# EAGLE schematic piezo-driver_v0.95-R002 (EAGLE 6.5.0)

## Sheet 1 of 3
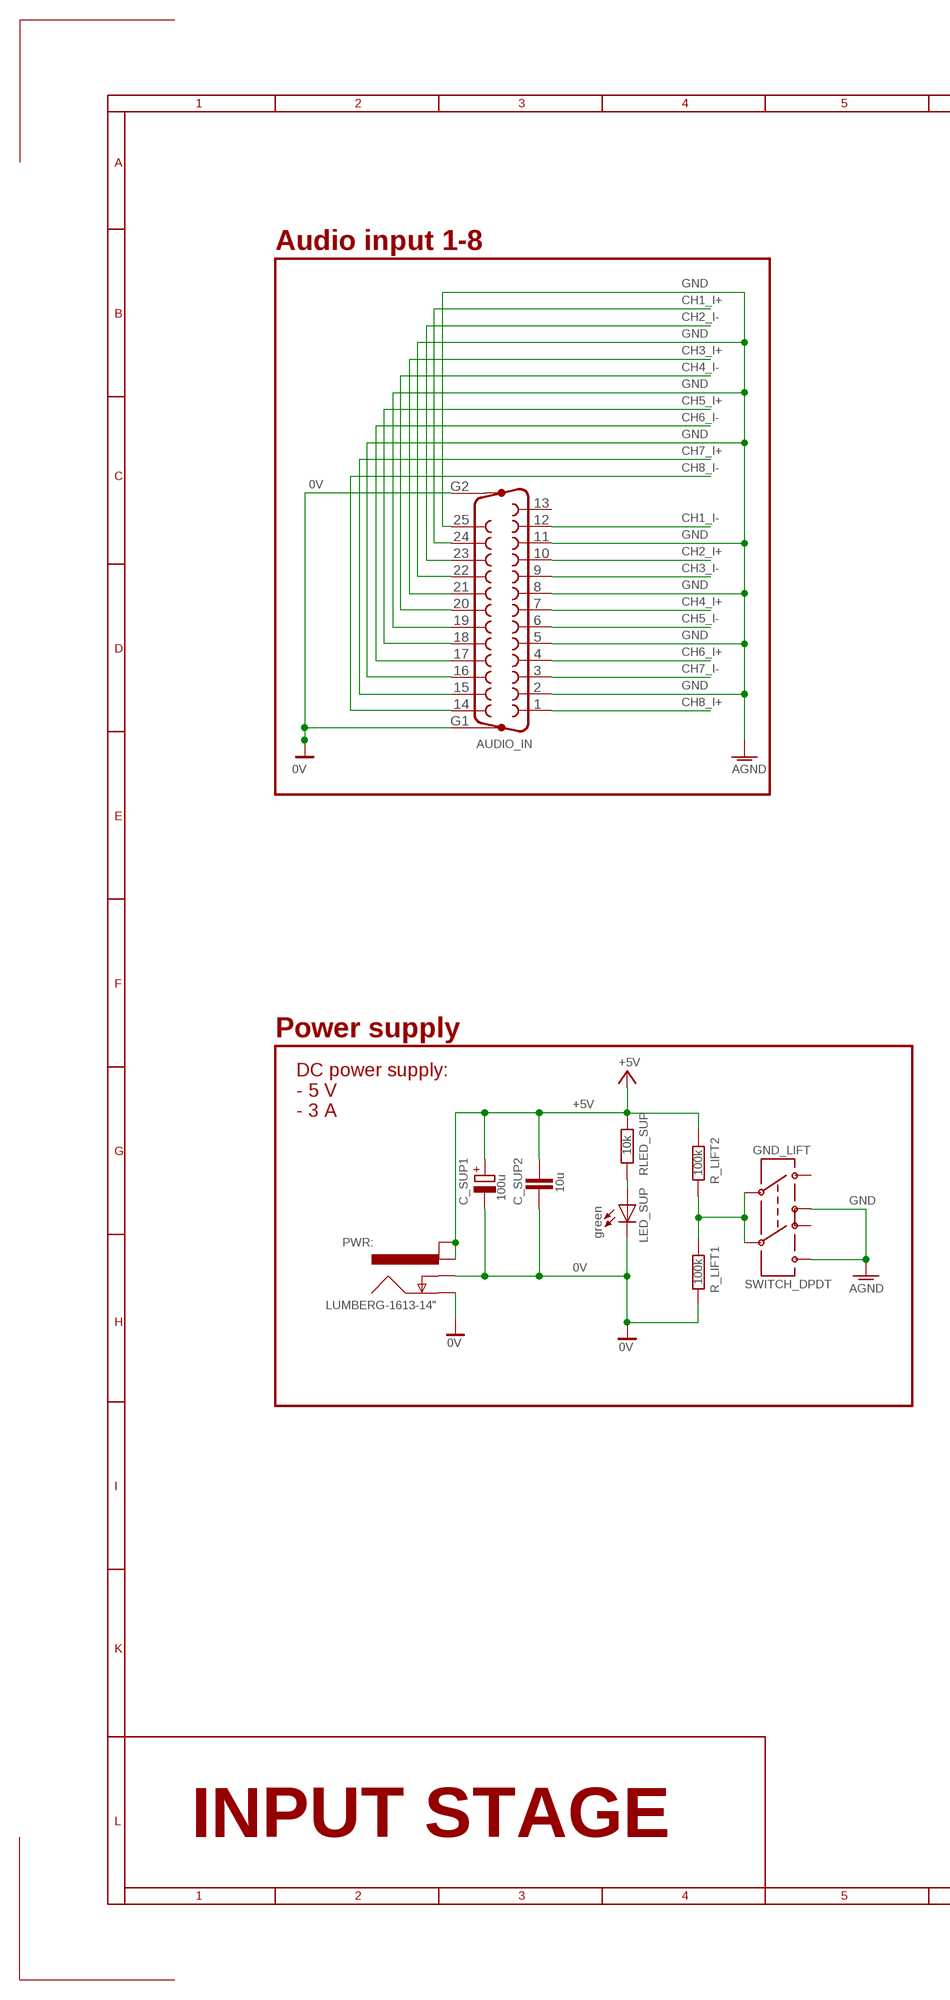
[diagram p0: schematic, sheet 1, part 1 of 2]
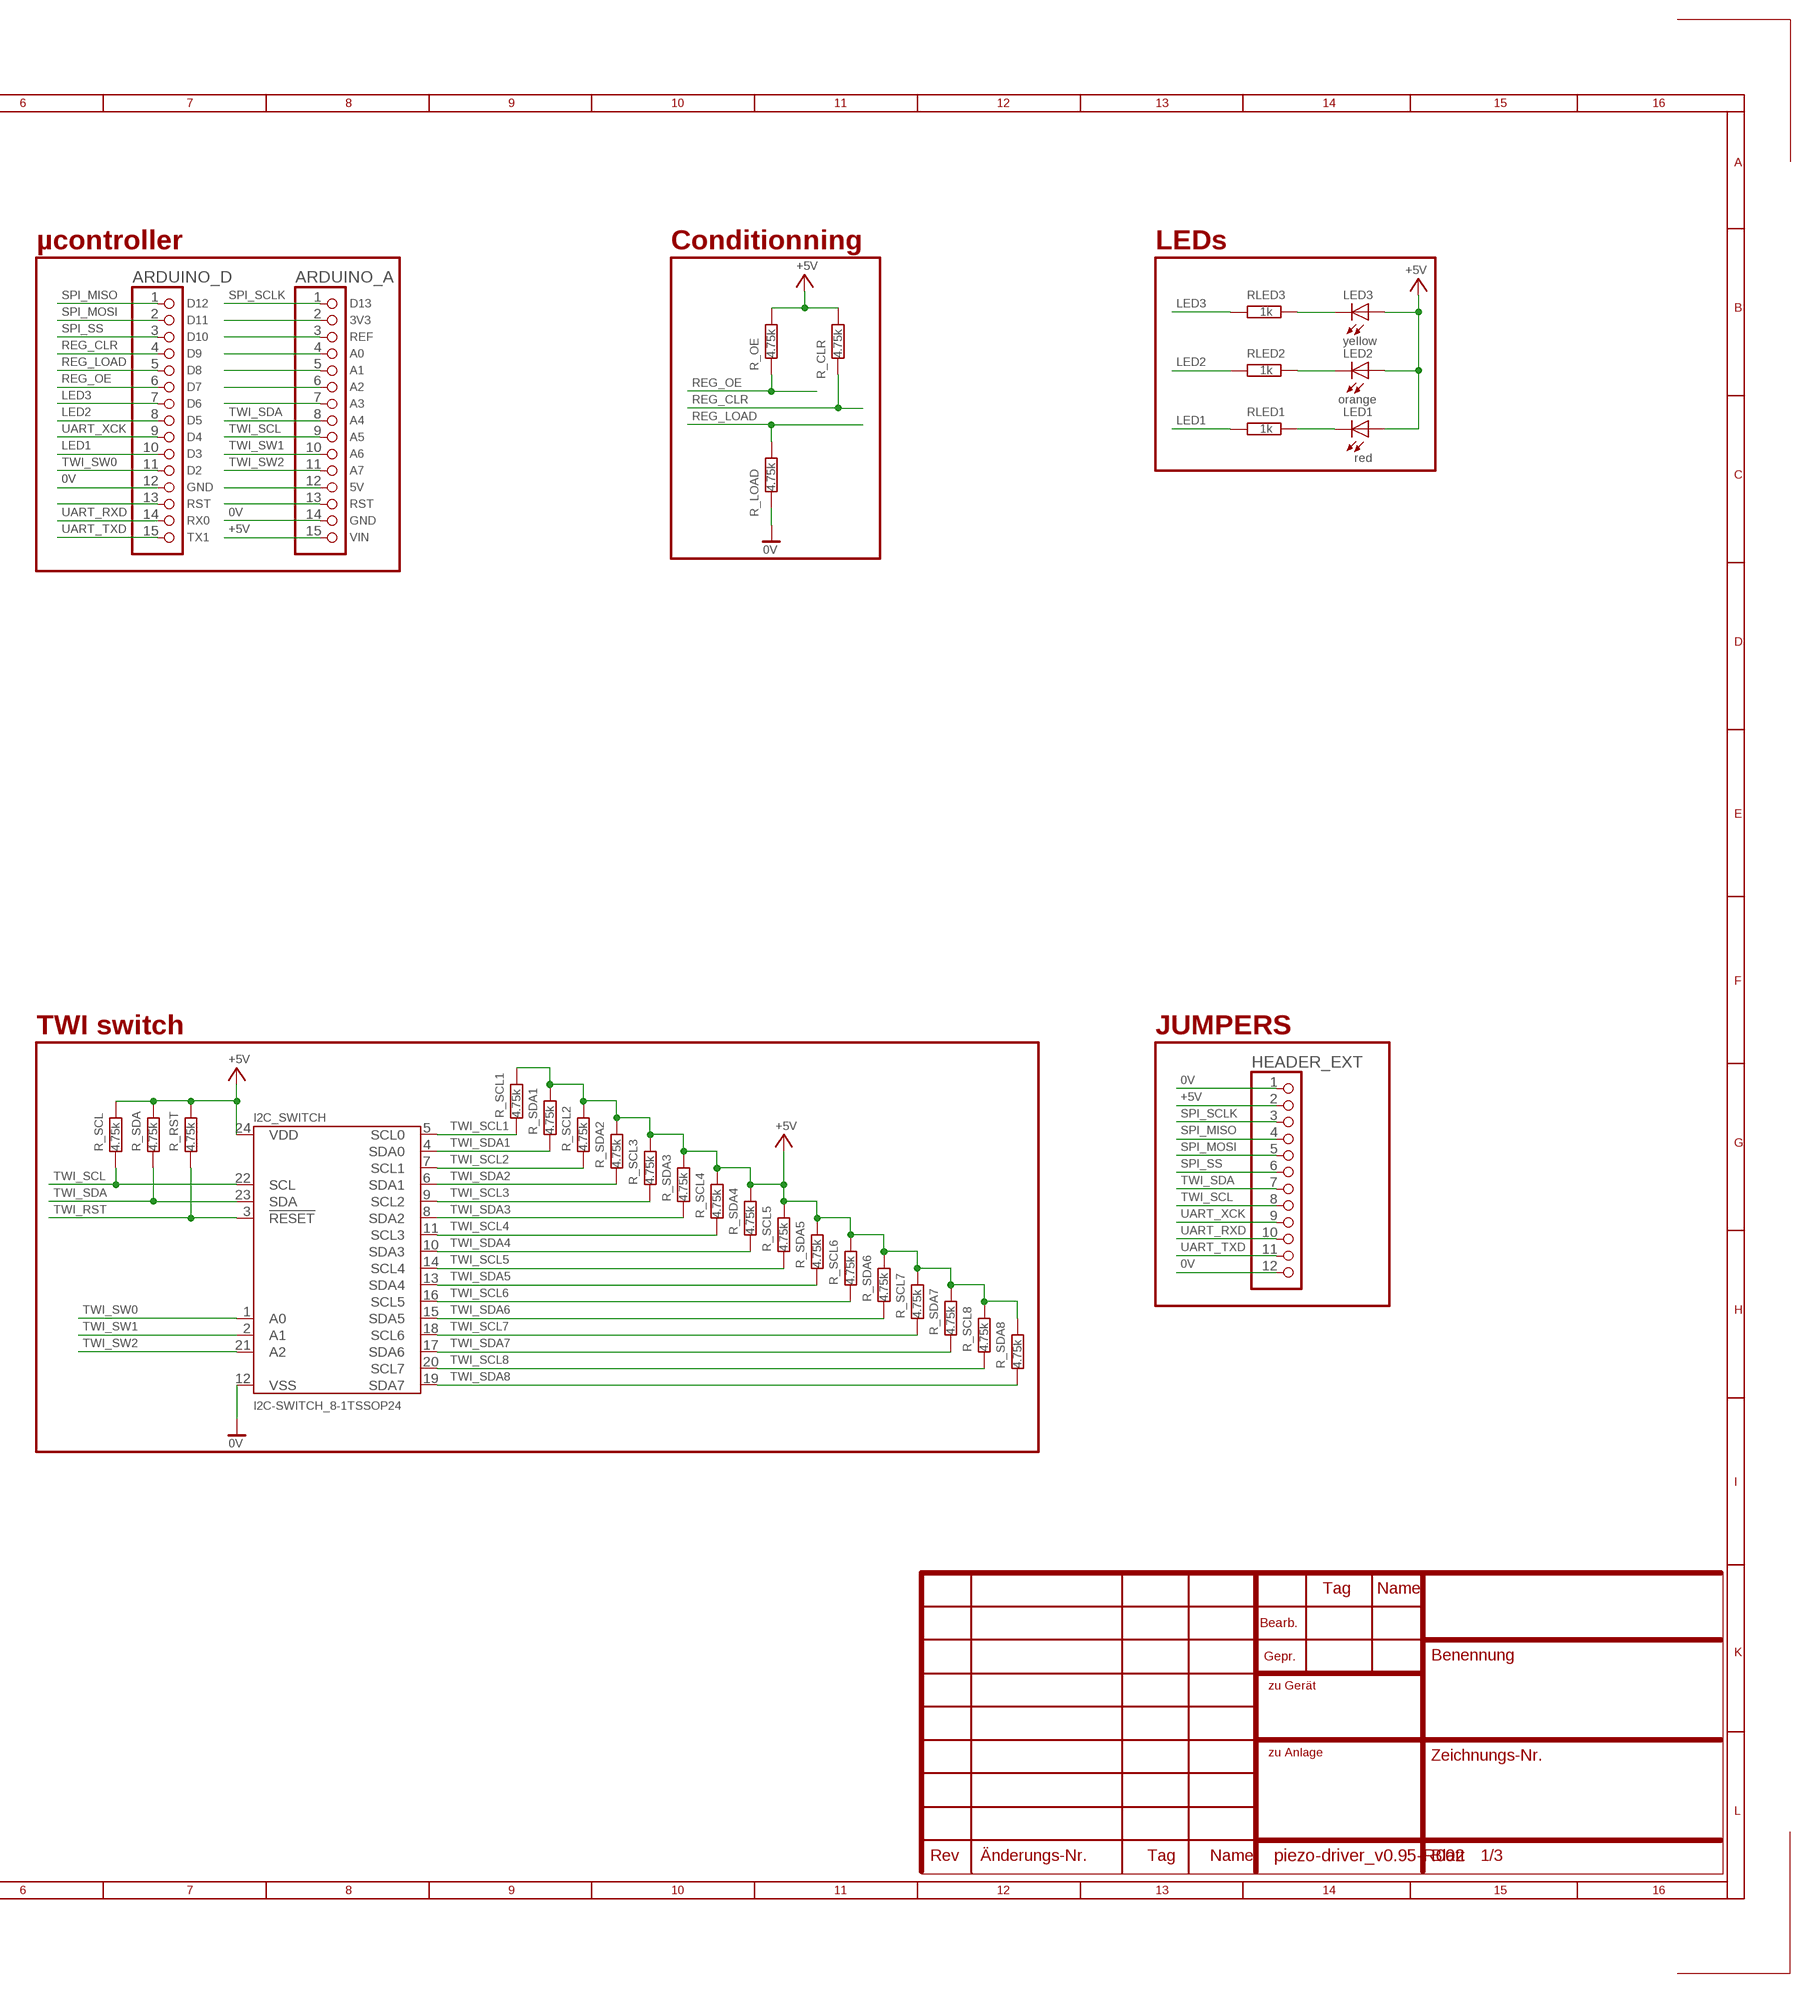
[diagram p1: schematic, sheet 1, part 2 of 2]

### Parts
ARDUINO_A  PINHD-1X15  [1X15]
ARDUINO_D  PINHD-1X15  [1X15]
AUDIO_IN  F25HP  [F25HP]
C_SUP1  100u  CAP_POL12061  [EIA3216]
C_SUP2  10u  C-EUC0805K  [C0805K]
GND_LIFT  SWITCH_DPDT  [SWITCH_JS202011]
HEADER_EXT  PINHD-1X12  [1X12]
I2C_SWITCH  I2C-SWITCH_8-1TSSOP24  [TSSOP24]
LED1  red  LED1206  [LED-1206]
LED2  orange  LED1206  [LED-1206]
LED3  yellow  LED1206  [LED-1206]
LED_SUP  green  LED1206  [LED-1206]
PWR:  LUMBERG-1613-14"  [LUMBERG-1613_14]
R_CLR  4.75k  R-EU_R0402  [R0402]
R_LIFT1  100k  R-EU_R0402  [R0402]
R_LIFT2  100k  R-EU_R0402  [R0402]
R_LOAD  4.75k  R-EU_R0402  [R0402]
R_OE  4.75k  R-EU_R0402  [R0402]
R_RST  4.75k  R-EU_R0402  [R0402]
R_SCL  4.75k  R-EU_R0402  [R0402]
R_SCL1  4.75k  R-EU_R0402  [R0402]
R_SCL2  4.75k  R-EU_R0402  [R0402]
R_SCL3  4.75k  R-EU_R0402  [R0402]
R_SCL4  4.75k  R-EU_R0402  [R0402]
R_SCL5  4.75k  R-EU_R0402  [R0402]
R_SCL6  4.75k  R-EU_R0402  [R0402]
R_SCL7  4.75k  R-EU_R0402  [R0402]
R_SCL8  4.75k  R-EU_R0402  [R0402]
R_SDA  4.75k  R-EU_R0402  [R0402]
R_SDA1  4.75k  R-EU_R0402  [R0402]
R_SDA2  4.75k  R-EU_R0402  [R0402]
R_SDA3  4.75k  R-EU_R0402  [R0402]
R_SDA4  4.75k  R-EU_R0402  [R0402]
R_SDA5  4.75k  R-EU_R0402  [R0402]
R_SDA6  4.75k  R-EU_R0402  [R0402]
R_SDA7  4.75k  R-EU_R0402  [R0402]
R_SDA8  4.75k  R-EU_R0402  [R0402]
RLED1  1k  R-EU_R0402  [R0402]
RLED2  1k  R-EU_R0402  [R0402]
RLED3  1k  R-EU_R0402  [R0402]
RLED_SUP  10k  R-EU_R0402  [R0402]

### Nets
0V: ARDUINO_A.14 ARDUINO_D.12 AUDIO_IN.G1 AUDIO_IN.G2 C_SUP1.C(-) C_SUP2.2 HEADER_EXT.1 HEADER_EXT.12 I2C_SWITCH.12(VSS) LED_SUP.C PWR:.1(GND) PWR:.2(GND_INS) R_LIFT1.1 R_LOAD.1 ; also sheet 2,3
+5V: ARDUINO_A.15 C_SUP1.A(+) C_SUP2.1 HEADER_EXT.2 I2C_SWITCH.24(VDD) LED1.A LED2.A LED3.A PWR:.3(PWR_1) PWR:.4(PWR_2) R_CLR.2 R_LIFT2.2 R_OE.2 R_RST.2 R_SCL1.2 R_SCL2.2 R_SCL3.2 R_SCL4.2 R_SCL5.2 R_SCL6.2 R_SCL7.2 R_SCL8.2 R_SCL.2 R_SDA1.2 R_SDA2.2 R_SDA3.2 R_SDA4.2 R_SDA5.2 R_SDA6.2 R_SDA7.2 R_SDA8.2 R_SDA.2 RLED_SUP.2 ; also sheet 2,3
A_3V3: ARDUINO_A.2
A_5V: ARDUINO_A.12
A_A0: ARDUINO_A.4
A_A1: ARDUINO_A.5
A_A2: ARDUINO_A.6
A_A3: ARDUINO_A.7
A_REF: ARDUINO_A.3
A_RST1: ARDUINO_D.13
A_RST2: ARDUINO_A.13
CH1_I+: AUDIO_IN.24 ; also sheet 2
CH1_I-: AUDIO_IN.12 ; also sheet 2
CH2_I+: AUDIO_IN.10 ; also sheet 2
CH2_I-: AUDIO_IN.23 ; also sheet 2
CH3_I+: AUDIO_IN.21 ; also sheet 2
CH3_I-: AUDIO_IN.9 ; also sheet 2
CH4_I+: AUDIO_IN.7 ; also sheet 2
CH4_I-: AUDIO_IN.20 ; also sheet 2
CH5_I+: AUDIO_IN.18 ; also sheet 2
CH5_I-: AUDIO_IN.6 ; also sheet 2
CH6_I+: AUDIO_IN.4 ; also sheet 2
CH6_I-: AUDIO_IN.17 ; also sheet 2
CH7_I+: AUDIO_IN.15 ; also sheet 2
CH7_I-: AUDIO_IN.3 ; also sheet 2
CH8_I+: AUDIO_IN.1 ; also sheet 2
CH8_I-: AUDIO_IN.14 ; also sheet 2
GND: AUDIO_IN.2 AUDIO_IN.5 AUDIO_IN.8 AUDIO_IN.11 AUDIO_IN.16 AUDIO_IN.19 AUDIO_IN.22 AUDIO_IN.25 GND_LIFT.1(T1A) GND_LIFT.6(T2A) ; supply symbol labelled AGND
LED1: ARDUINO_D.10 RLED1.1
LED2: ARDUINO_D.8 RLED2.1
LED3: ARDUINO_D.7 RLED3.1
N$15: LED_SUP.A RLED_SUP.1
N$68: LED3.C RLED3.2
N$69: LED2.C RLED2.2
N$70: LED1.C RLED1.2
N$1222: GND_LIFT.2(P1) GND_LIFT.5(P2) R_LIFT1.2 R_LIFT2.1
REG_CLR: ARDUINO_D.4 R_CLR.1 ; also sheet 3
REG_LOAD: ARDUINO_D.5 R_LOAD.2 ; also sheet 3
REG_OE: ARDUINO_D.6 R_OE.1 ; also sheet 3
SPI_MISO: ARDUINO_D.1 HEADER_EXT.4
SPI_MOSI: ARDUINO_D.2 HEADER_EXT.5 ; also sheet 3
SPI_SCLK: ARDUINO_A.1 HEADER_EXT.3 ; also sheet 3
SPI_SS: ARDUINO_D.3 HEADER_EXT.6
TWI_RST: I2C_SWITCH.3(!RESET) R_RST.1
TWI_SCL: ARDUINO_A.9 HEADER_EXT.8 I2C_SWITCH.22(SCL) R_SCL.1
TWI_SCL1: I2C_SWITCH.5(SCL0) R_SCL1.1 ; also sheet 2
TWI_SCL2: I2C_SWITCH.7(SCL1) R_SCL2.1 ; also sheet 2
TWI_SCL3: I2C_SWITCH.9(SCL2) R_SCL3.1 ; also sheet 2
TWI_SCL4: I2C_SWITCH.11(SCL3) R_SCL4.1 ; also sheet 2
TWI_SCL5: I2C_SWITCH.14(SCL4) R_SCL5.1 ; also sheet 2
TWI_SCL6: I2C_SWITCH.16(SCL5) R_SCL6.1 ; also sheet 2
TWI_SCL7: I2C_SWITCH.18(SCL6) R_SCL7.1 ; also sheet 2
TWI_SCL8: I2C_SWITCH.20(SCL7) R_SCL8.1 ; also sheet 2
TWI_SDA: ARDUINO_A.8 HEADER_EXT.7 I2C_SWITCH.23(SDA) R_SDA.1
TWI_SDA1: I2C_SWITCH.4(SDA0) R_SDA1.1 ; also sheet 2
TWI_SDA2: I2C_SWITCH.6(SDA1) R_SDA2.1 ; also sheet 2
TWI_SDA3: I2C_SWITCH.8(SDA2) R_SDA3.1 ; also sheet 2
TWI_SDA4: I2C_SWITCH.10(SDA3) R_SDA4.1 ; also sheet 2
TWI_SDA5: I2C_SWITCH.13(SDA4) R_SDA5.1 ; also sheet 2
TWI_SDA6: I2C_SWITCH.15(SDA5) R_SDA6.1 ; also sheet 2
TWI_SDA7: I2C_SWITCH.17(SDA6) R_SDA7.1 ; also sheet 2
TWI_SDA8: I2C_SWITCH.19(SDA7) R_SDA8.1 ; also sheet 2
TWI_SW0: ARDUINO_D.11 I2C_SWITCH.1(A0)
TWI_SW1: ARDUINO_A.10 I2C_SWITCH.2(A1)
TWI_SW2: ARDUINO_A.11 I2C_SWITCH.21(A2)
UART_RXD: ARDUINO_D.14 HEADER_EXT.10
UART_TXD: ARDUINO_D.15 HEADER_EXT.11
UART_XCK: ARDUINO_D.9 HEADER_EXT.9
Unconnected: AUDIO_IN.13 GND_LIFT.3(T1B) GND_LIFT.4(T2B)

### Notes on the sheet
- Audio input 1-8 | µcontroller | Conditionning | LEDs
- D12 | D13
- D11 | 3V3
- D10 | REF
- D9 | A0
- D8 | A1
- D7 | A2
- D6 | A3
- D5 | A4
- D4 | A5
- D3 | A6
- D2 | A7
- GND | 5V
- RST | RST
- RX0 | GND
- TX1 | VIN
- Power supply | TWI switch | JUMPERS
- DC power supply:
  - 5 V
  - 3 A
- INPUT STAGE

## Sheet 2 of 3
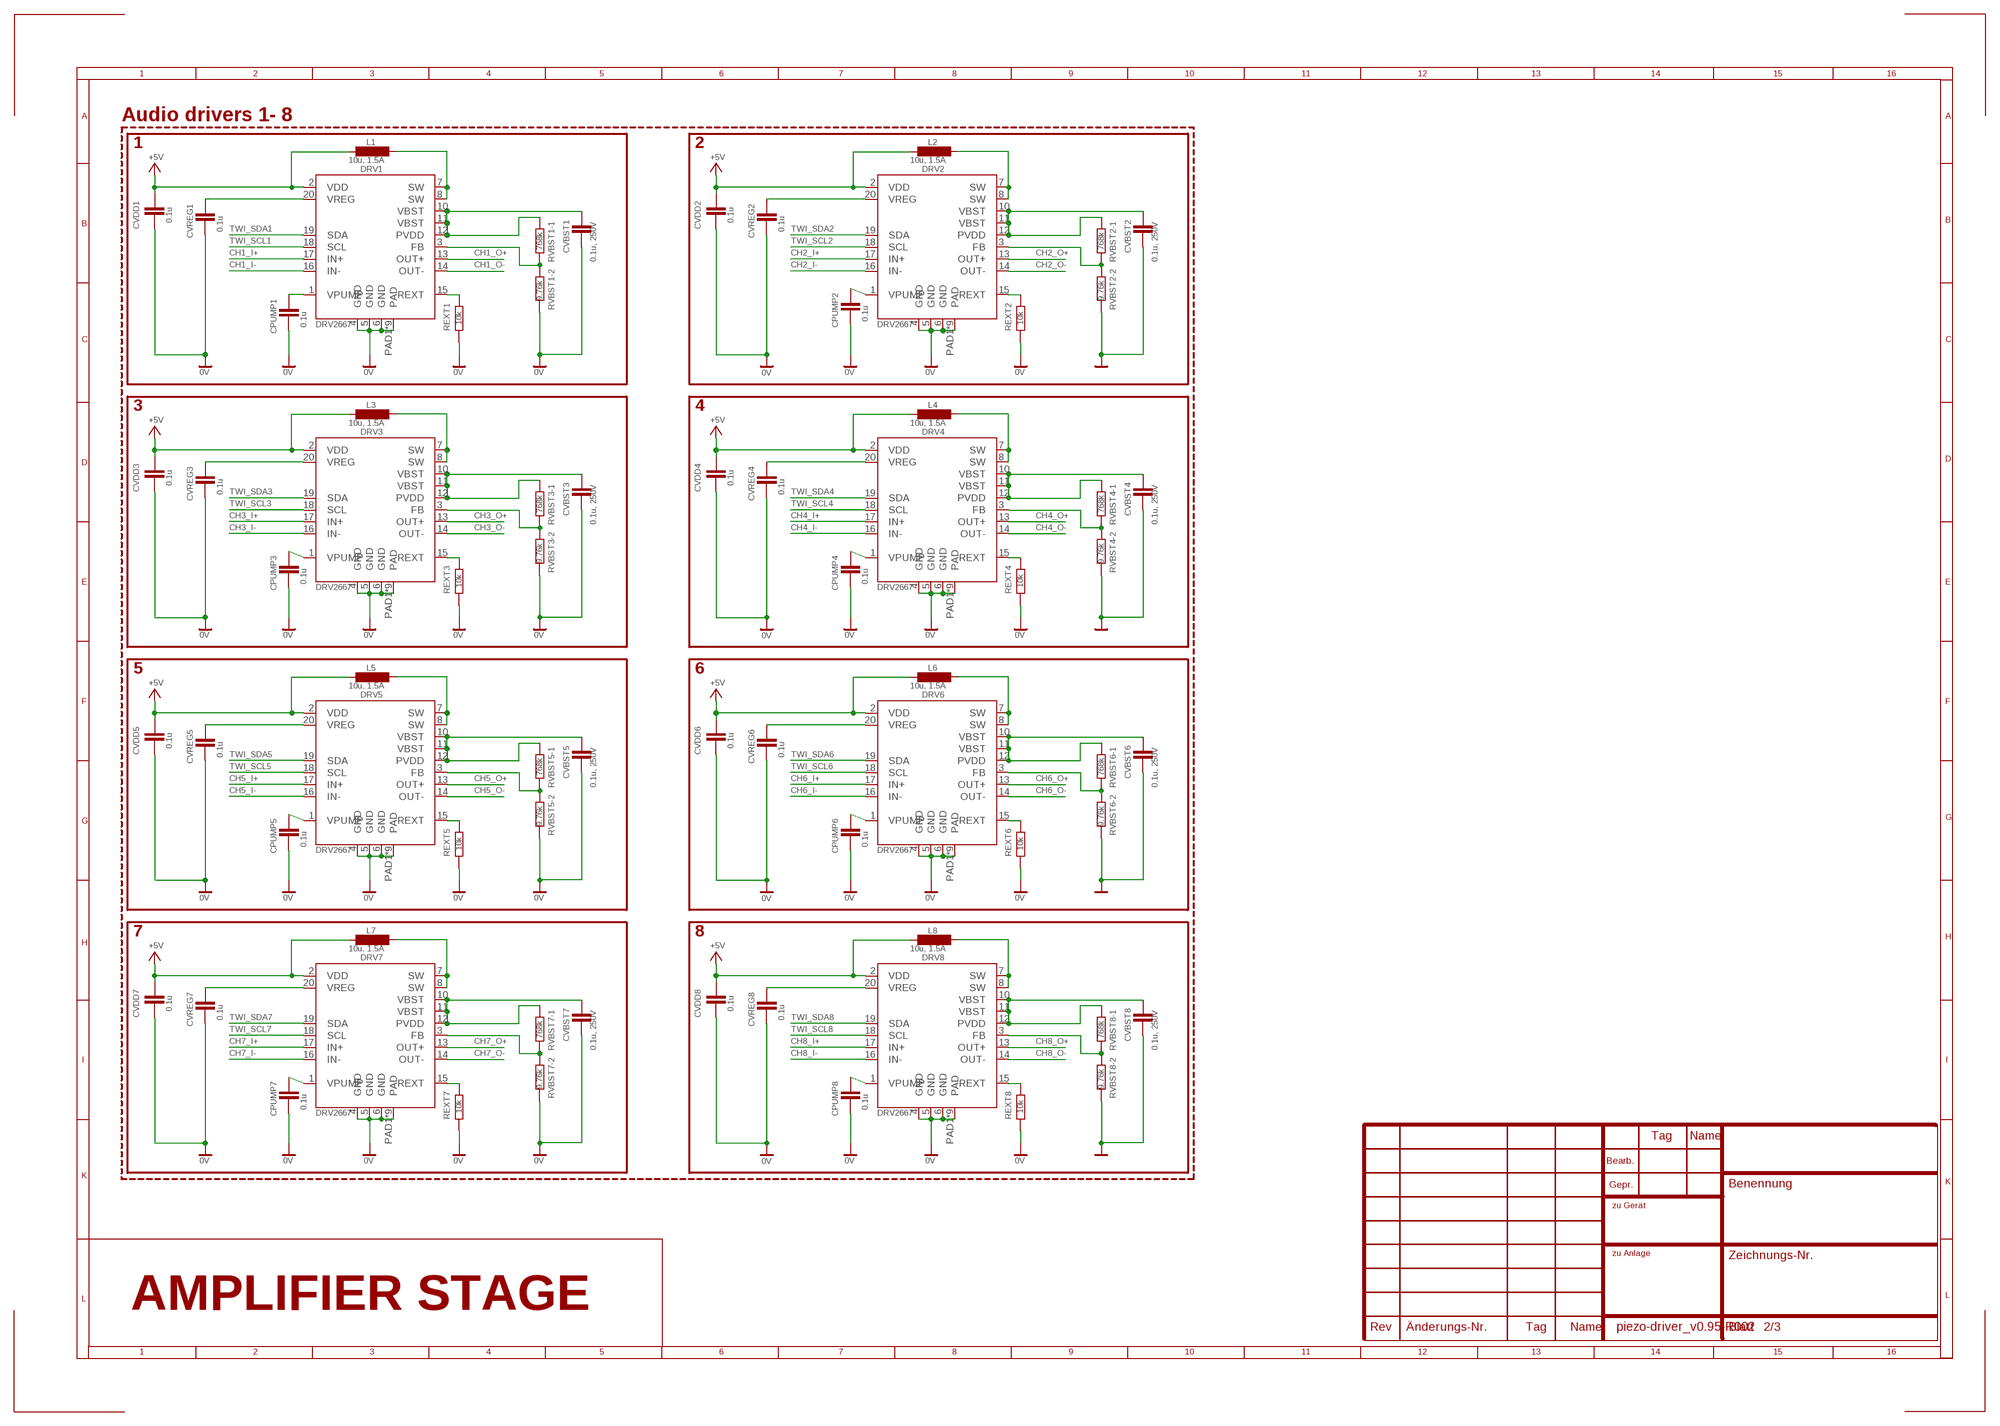
[diagram p2: schematic, sheet 2]

### Parts
CPUMP1  0.1u  C-EUC0402  [C0402]
CPUMP2  0.1u  C-EUC0402  [C0402]
CPUMP3  0.1u  C-EUC0402  [C0402]
CPUMP4  0.1u  C-EUC0402  [C0402]
CPUMP5  0.1u  C-EUC0402  [C0402]
CPUMP6  0.1u  C-EUC0402  [C0402]
CPUMP7  0.1u  C-EUC0402  [C0402]
CPUMP8  0.1u  C-EUC0402  [C0402]
CVBST1  0.1u, 250V  C-EUC0805  [C0805]
CVBST2  0.1u, 250V  C-EUC0805  [C0805]
CVBST3  0.1u, 250V  C-EUC0805  [C0805]
CVBST4  0.1u, 250V  C-EUC0805  [C0805]
CVBST5  0.1u, 250V  C-EUC0805  [C0805]
CVBST6  0.1u, 250V  C-EUC0805  [C0805]
CVBST7  0.1u, 250V  C-EUC0805  [C0805]
CVBST8  0.1u, 250V  C-EUC0805  [C0805]
CVDD1  0.1u  C-EUC0402  [C0402]
CVDD2  0.1u  C-EUC0402  [C0402]
CVDD3  0.1u  C-EUC0402  [C0402]
CVDD4  0.1u  C-EUC0402  [C0402]
CVDD5  0.1u  C-EUC0402  [C0402]
CVDD6  0.1u  C-EUC0402  [C0402]
CVDD7  0.1u  C-EUC0402  [C0402]
CVDD8  0.1u  C-EUC0402  [C0402]
CVREG1  0.1u  C-EUC0402  [C0402]
CVREG2  0.1u  C-EUC0402  [C0402]
CVREG3  0.1u  C-EUC0402  [C0402]
CVREG4  0.1u  C-EUC0402  [C0402]
CVREG5  0.1u  C-EUC0402  [C0402]
CVREG6  0.1u  C-EUC0402  [C0402]
CVREG7  0.1u  C-EUC0402  [C0402]
CVREG8  0.1u  C-EUC0402  [C0402]
DRV1  DRV2667  [QFN-20_9TH]
DRV2  DRV2667  [QFN-20_9TH]
DRV3  DRV2667  [QFN-20_9TH]
DRV4  DRV2667  [QFN-20_9TH]
DRV5  DRV2667  [QFN-20_9TH]
DRV6  DRV2667  [QFN-20_9TH]
DRV7  DRV2667  [QFN-20_9TH]
DRV8  DRV2667  [QFN-20_9TH]
L1  10u, 1.5A  L-EU4.0X4.0  [L4.0X4.0]
L2  10u, 1.5A  L-EU4.0X4.0  [L4.0X4.0]
L3  10u, 1.5A  L-EU4.0X4.0  [L4.0X4.0]
L4  10u, 1.5A  L-EU4.0X4.0  [L4.0X4.0]
L5  10u, 1.5A  L-EU4.0X4.0  [L4.0X4.0]
L6  10u, 1.5A  L-EU4.0X4.0  [L4.0X4.0]
L7  10u, 1.5A  L-EU4.0X4.0  [L4.0X4.0]
L8  10u, 1.5A  L-EU4.0X4.0  [L4.0X4.0]
REXT1  10k  R-EU_R0402  [R0402]
REXT2  10k  R-EU_R0402  [R0402]
REXT3  10k  R-EU_R0402  [R0402]
REXT4  10k  R-EU_R0402  [R0402]
REXT5  10k  R-EU_R0402  [R0402]
REXT6  10k  R-EU_R0402  [R0402]
REXT7  10k  R-EU_R0402  [R0402]
REXT8  10k  R-EU_R0402  [R0402]
RVBST1-1  768k  R-EU_R0402  [R0402]
RVBST1-2  9.76k  R-EU_R0402  [R0402]
RVBST2-1  768k  R-EU_R0402  [R0402]
RVBST2-2  9.76k  R-EU_R0402  [R0402]
RVBST3-1  768k  R-EU_R0402  [R0402]
RVBST3-2  9.76k  R-EU_R0402  [R0402]
RVBST4-1  768k  R-EU_R0402  [R0402]
RVBST4-2  9.76k  R-EU_R0402  [R0402]
RVBST5-1  768k  R-EU_R0402  [R0402]
RVBST5-2  9.76k  R-EU_R0402  [R0402]
RVBST6-1  768k  R-EU_R0402  [R0402]
RVBST6-2  9.76k  R-EU_R0402  [R0402]
RVBST7-1  768k  R-EU_R0402  [R0402]
RVBST7-2  9.76k  R-EU_R0402  [R0402]
RVBST8-1  768k  R-EU_R0402  [R0402]
RVBST8-2  9.76k  R-EU_R0402  [R0402]

### Nets
0V: CPUMP1.2 CPUMP2.2 CPUMP3.2 CPUMP4.2 CPUMP5.2 CPUMP6.2 CPUMP7.2 CPUMP8.2 CVBST1.2 CVBST2.2 CVBST3.2 CVBST4.2 CVBST5.2 CVBST6.2 CVBST7.2 CVBST8.2 CVDD1.2 CVDD2.2 CVDD3.2 CVDD4.2 CVDD5.2 CVDD6.2 CVDD7.2 CVDD8.2 CVREG1.2 CVREG2.2 CVREG3.2 CVREG4.2 CVREG5.2 CVREG6.2 CVREG7.2 CVREG8.2 DRV1.4(GND) DRV1.5(GND) DRV1.6(GND) DRV1.PAD1(PAD) DRV1.PAD2(PAD) DRV1.PAD3(PAD) DRV1.PAD4(PAD) DRV1.PAD5(PAD) DRV1.PAD6(PAD) DRV1.PAD7(PAD) DRV1.PAD8(PAD) DRV1.PAD9(PAD) DRV2.4(GND) DRV2.5(GND) DRV2.6(GND) DRV2.PAD1(PAD) DRV2.PAD2(PAD) DRV2.PAD3(PAD) DRV2.PAD4(PAD) DRV2.PAD5(PAD) DRV2.PAD6(PAD) DRV2.PAD7(PAD) DRV2.PAD8(PAD) DRV2.PAD9(PAD) DRV3.4(GND) DRV3.5(GND) DRV3.6(GND) DRV3.PAD1(PAD) DRV3.PAD2(PAD) DRV3.PAD3(PAD) DRV3.PAD4(PAD) DRV3.PAD5(PAD) DRV3.PAD6(PAD) DRV3.PAD7(PAD) DRV3.PAD8(PAD) DRV3.PAD9(PAD) DRV4.4(GND) DRV4.5(GND) DRV4.6(GND) DRV4.PAD1(PAD) DRV4.PAD2(PAD) DRV4.PAD3(PAD) DRV4.PAD4(PAD) DRV4.PAD5(PAD) DRV4.PAD6(PAD) DRV4.PAD7(PAD) DRV4.PAD8(PAD) DRV4.PAD9(PAD) DRV5.4(GND) DRV5.5(GND) DRV5.6(GND) DRV5.PAD1(PAD) DRV5.PAD2(PAD) DRV5.PAD3(PAD) DRV5.PAD4(PAD) DRV5.PAD5(PAD) DRV5.PAD6(PAD) DRV5.PAD7(PAD) DRV5.PAD8(PAD) DRV5.PAD9(PAD) DRV6.4(GND) DRV6.5(GND) DRV6.6(GND) DRV6.PAD1(PAD) DRV6.PAD2(PAD) DRV6.PAD3(PAD) DRV6.PAD4(PAD) DRV6.PAD5(PAD) DRV6.PAD6(PAD) DRV6.PAD7(PAD) DRV6.PAD8(PAD) DRV6.PAD9(PAD) DRV7.4(GND) DRV7.5(GND) DRV7.6(GND) DRV7.PAD1(PAD) DRV7.PAD2(PAD) DRV7.PAD3(PAD) DRV7.PAD4(PAD) DRV7.PAD5(PAD) DRV7.PAD6(PAD) DRV7.PAD7(PAD) DRV7.PAD8(PAD) DRV7.PAD9(PAD) DRV8.4(GND) DRV8.5(GND) DRV8.6(GND) DRV8.PAD1(PAD) DRV8.PAD2(PAD) DRV8.PAD3(PAD) DRV8.PAD4(PAD) DRV8.PAD5(PAD) DRV8.PAD6(PAD) DRV8.PAD7(PAD) DRV8.PAD8(PAD) DRV8.PAD9(PAD) REXT1.1 REXT2.1 REXT3.1 REXT4.1 REXT5.1 REXT6.1 REXT7.1 REXT8.1 RVBST1-2.1 RVBST2-2.1 RVBST3-2.1 RVBST4-2.1 RVBST5-2.1 RVBST6-2.1 RVBST7-2.1 RVBST8-2.1 ; also sheet 1,3
+5V: CVDD1.1 CVDD2.1 CVDD3.1 CVDD4.1 CVDD5.1 CVDD6.1 CVDD7.1 CVDD8.1 DRV1.2(VDD) DRV2.2(VDD) DRV3.2(VDD) DRV4.2(VDD) DRV5.2(VDD) DRV6.2(VDD) DRV7.2(VDD) DRV8.2(VDD) L1.2 L2.2 L3.2 L4.2 L5.2 L6.2 L7.2 L8.2 ; also sheet 1,3
CH1_I+: DRV1.17(IN+) ; also sheet 1
CH1_I-: DRV1.16(IN-) ; also sheet 1
CH1_O+: DRV1.13(OUT+) ; also sheet 3
CH1_O-: DRV1.14(OUT-) ; also sheet 3
CH2_I+: DRV2.17(IN+) ; also sheet 1
CH2_I-: DRV2.16(IN-) ; also sheet 1
CH2_O+: DRV2.13(OUT+) ; also sheet 3
CH2_O-: DRV2.14(OUT-) ; also sheet 3
CH3_I+: DRV3.17(IN+) ; also sheet 1
CH3_I-: DRV3.16(IN-) ; also sheet 1
CH3_O+: DRV3.13(OUT+) ; also sheet 3
CH3_O-: DRV3.14(OUT-) ; also sheet 3
CH4_I+: DRV4.17(IN+) ; also sheet 1
CH4_I-: DRV4.16(IN-) ; also sheet 1
CH4_O+: DRV4.13(OUT+) ; also sheet 3
CH4_O-: DRV4.14(OUT-) ; also sheet 3
CH5_I+: DRV5.17(IN+) ; also sheet 1
CH5_I-: DRV5.16(IN-) ; also sheet 1
CH5_O+: DRV5.13(OUT+) ; also sheet 3
CH5_O-: DRV5.14(OUT-) ; also sheet 3
CH6_I+: DRV6.17(IN+) ; also sheet 1
CH6_I-: DRV6.16(IN-) ; also sheet 1
CH6_O+: DRV6.13(OUT+) ; also sheet 3
CH6_O-: DRV6.14(OUT-) ; also sheet 3
CH7_I+: DRV7.17(IN+) ; also sheet 1
CH7_I-: DRV7.16(IN-) ; also sheet 1
CH7_O+: DRV7.13(OUT+) ; also sheet 3
CH7_O-: DRV7.14(OUT-) ; also sheet 3
CH8_I+: DRV8.17(IN+) ; also sheet 1
CH8_I-: DRV8.16(IN-) ; also sheet 1
CH8_O+: DRV8.13(OUT+) ; also sheet 3
CH8_O-: DRV8.14(OUT-) ; also sheet 3
CVBST1: CVBST1.1 DRV1.10(VBST) DRV1.11(VBST) DRV1.12(PVDD) RVBST1-1.2
CVBST2: CVBST2.1 DRV2.10(VBST) DRV2.11(VBST) DRV2.12(PVDD) RVBST2-1.2
CVBST3: CVBST3.1 DRV3.10(VBST) DRV3.11(VBST) DRV3.12(PVDD) RVBST3-1.2
CVBST4: CVBST4.1 DRV4.10(VBST) DRV4.11(VBST) DRV4.12(PVDD) RVBST4-1.2
CVBST5: CVBST5.1 DRV5.10(VBST) DRV5.11(VBST) DRV5.12(PVDD) RVBST5-1.2
CVBST6: CVBST6.1 DRV6.10(VBST) DRV6.11(VBST) DRV6.12(PVDD) RVBST6-1.2
CVBST7: CVBST7.1 DRV7.10(VBST) DRV7.11(VBST) DRV7.12(PVDD) RVBST7-1.2
CVBST8: CVBST8.1 DRV8.10(VBST) DRV8.11(VBST) DRV8.12(PVDD) RVBST8-1.2
L1: DRV1.7(SW) DRV1.8(SW) L1.1
L2: DRV2.7(SW) DRV2.8(SW) L2.1
L3: DRV3.7(SW) DRV3.8(SW) L3.1
L4: DRV4.7(SW) DRV4.8(SW) L4.1
L5: DRV5.7(SW) DRV5.8(SW) L5.1
L6: DRV6.7(SW) DRV6.8(SW) L6.1
L7: DRV7.7(SW) DRV7.8(SW) L7.1
L8: DRV8.7(SW) DRV8.8(SW) L8.1
N$4: DRV1.3(FB) RVBST1-1.1 RVBST1-2.2
N$5: DRV1.15(REXT) REXT1.2
N$6: CPUMP1.1 DRV1.1(VPUMP)
N$7: CVREG1.1 DRV1.20(VREG)
N$9: DRV3.3(FB) RVBST3-1.1 RVBST3-2.2
N$10: DRV3.15(REXT) REXT3.2
N$11: CPUMP3.1 DRV3.1(VPUMP)
N$12: CVREG3.1 DRV3.20(VREG)
N$16: DRV4.3(FB) RVBST4-1.1 RVBST4-2.2
N$17: DRV4.15(REXT) REXT4.2
N$18: CPUMP4.1 DRV4.1(VPUMP)
N$19: CVREG4.1 DRV4.20(VREG)
N$23: DRV2.3(FB) RVBST2-1.1 RVBST2-2.2
N$24: DRV2.15(REXT) REXT2.2
N$25: CPUMP2.1 DRV2.1(VPUMP)
N$26: CVREG2.1 DRV2.20(VREG)
N$28: DRV5.3(FB) RVBST5-1.1 RVBST5-2.2
N$29: DRV5.15(REXT) REXT5.2
N$30: CPUMP5.1 DRV5.1(VPUMP)
N$31: CVREG5.1 DRV5.20(VREG)
N$34: DRV6.3(FB) RVBST6-1.1 RVBST6-2.2
N$35: DRV6.15(REXT) REXT6.2
N$36: CPUMP6.1 DRV6.1(VPUMP)
N$37: CVREG6.1 DRV6.20(VREG)
N$40: DRV7.3(FB) RVBST7-1.1 RVBST7-2.2
N$41: DRV7.15(REXT) REXT7.2
N$42: CPUMP7.1 DRV7.1(VPUMP)
N$43: CVREG7.1 DRV7.20(VREG)
N$46: DRV8.3(FB) RVBST8-1.1 RVBST8-2.2
N$47: DRV8.15(REXT) REXT8.2
N$48: CPUMP8.1 DRV8.1(VPUMP)
N$49: CVREG8.1 DRV8.20(VREG)
TWI_SCL1: DRV1.18(SCL) ; also sheet 1
TWI_SCL2: DRV2.18(SCL) ; also sheet 1
TWI_SCL3: DRV3.18(SCL) ; also sheet 1
TWI_SCL4: DRV4.18(SCL) ; also sheet 1
TWI_SCL5: DRV5.18(SCL) ; also sheet 1
TWI_SCL6: DRV6.18(SCL) ; also sheet 1
TWI_SCL7: DRV7.18(SCL) ; also sheet 1
TWI_SCL8: DRV8.18(SCL) ; also sheet 1
TWI_SDA1: DRV1.19(SDA) ; also sheet 1
TWI_SDA2: DRV2.19(SDA) ; also sheet 1
TWI_SDA3: DRV3.19(SDA) ; also sheet 1
TWI_SDA4: DRV4.19(SDA) ; also sheet 1
TWI_SDA5: DRV5.19(SDA) ; also sheet 1
TWI_SDA6: DRV6.19(SDA) ; also sheet 1
TWI_SDA7: DRV7.19(SDA) ; also sheet 1
TWI_SDA8: DRV8.19(SDA) ; also sheet 1

### Notes on the sheet
- Audio drivers 1- 8
- 1 | 2
- 3 | 4
- 5 | 6
- 7 | 8
- AMPLIFIER STAGE

## Sheet 3 of 3
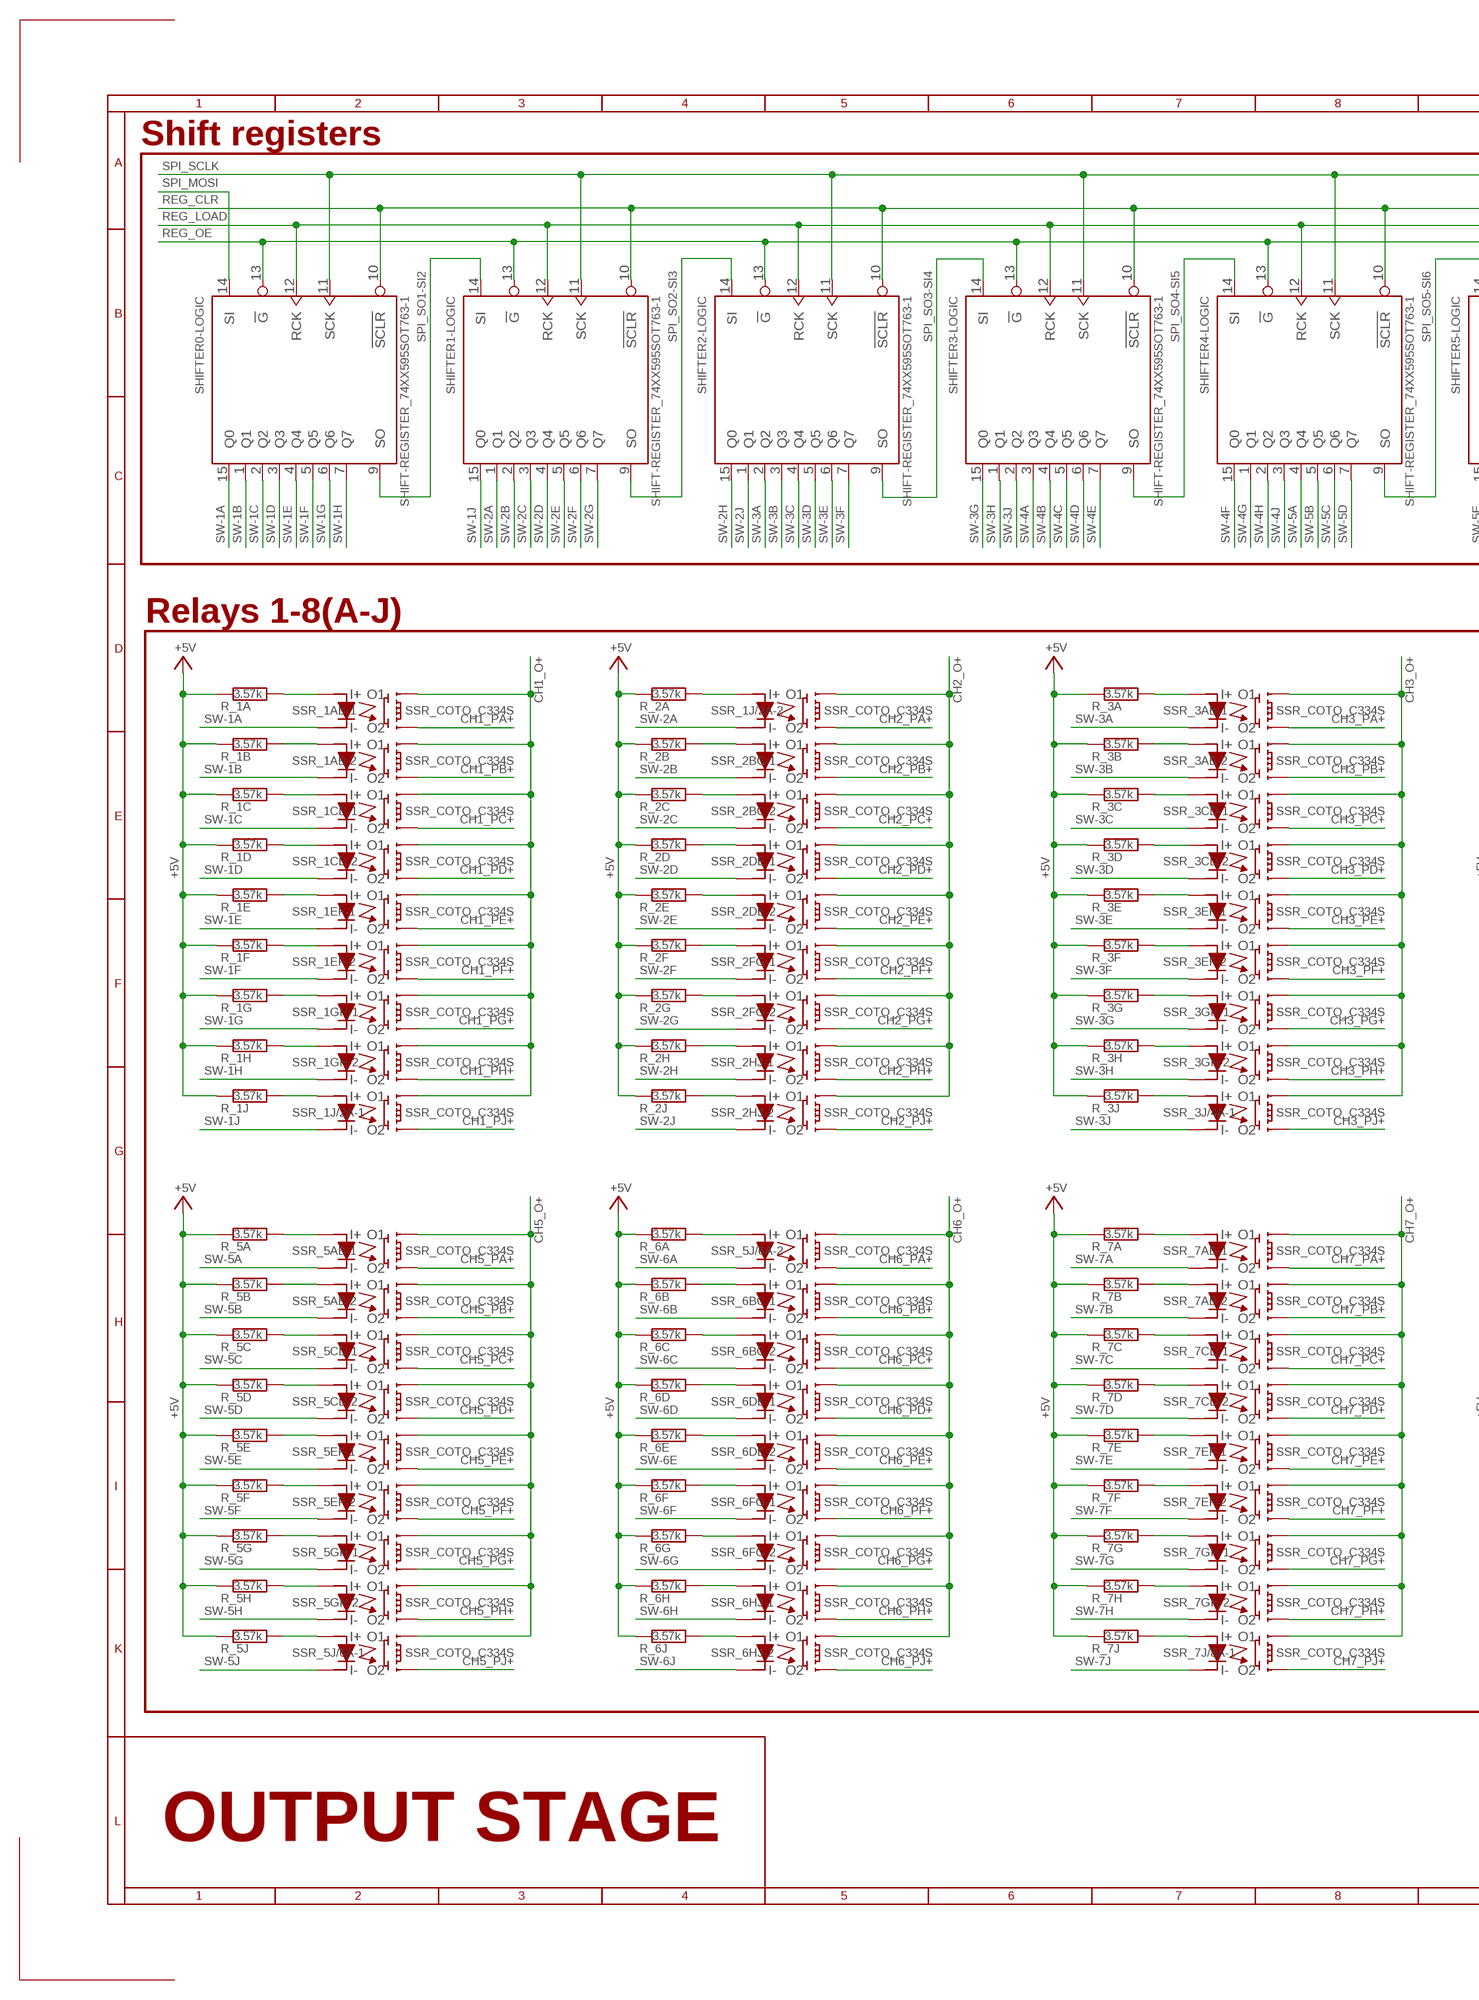
[diagram p3: schematic, sheet 3, part 1 of 2]
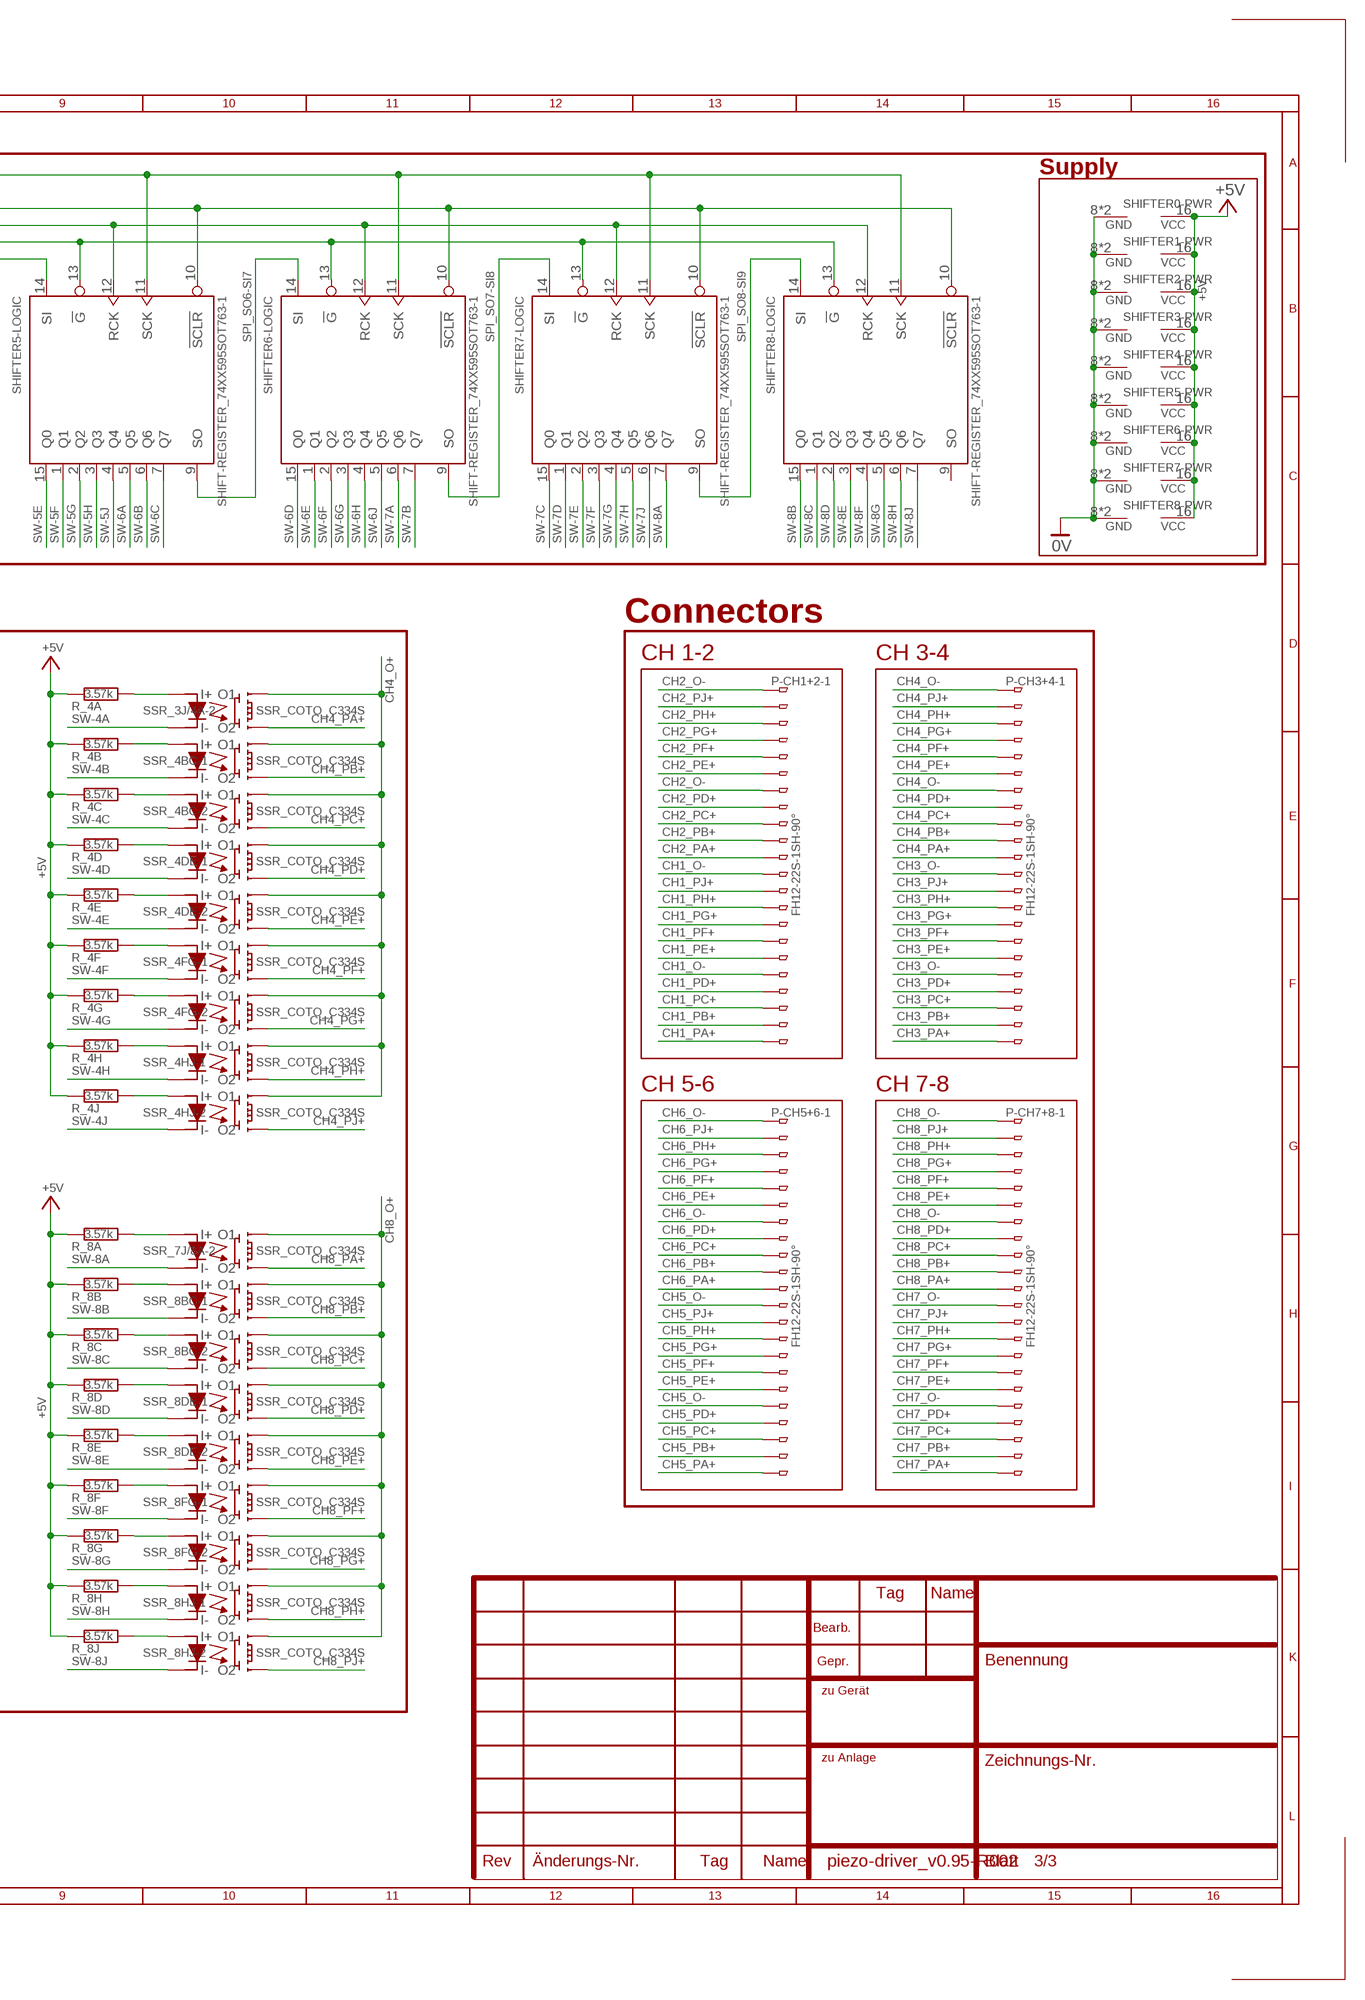
[diagram p4: schematic, sheet 3, part 2 of 2]

### Parts
P-CH1+2  FH12-22S-1SH-90°  [FH12-22S-1SH]
P-CH3+4  FH12-22S-1SH-90°  [FH12-22S-1SH]
P-CH5+6  FH12-22S-1SH-90°  [FH12-22S-1SH]
P-CH7+8  FH12-22S-1SH-90°  [FH12-22S-1SH]
R_1A  3.57k  R-EU_R0402  [R0402]
R_1B  3.57k  R-EU_R0402  [R0402]
R_1C  3.57k  R-EU_R0402  [R0402]
R_1D  3.57k  R-EU_R0402  [R0402]
R_1E  3.57k  R-EU_R0402  [R0402]
R_1F  3.57k  R-EU_R0402  [R0402]
R_1G  3.57k  R-EU_R0402  [R0402]
R_1H  3.57k  R-EU_R0402  [R0402]
R_1J  3.57k  R-EU_R0402  [R0402]
R_2A  3.57k  R-EU_R0402  [R0402]
R_2B  3.57k  R-EU_R0402  [R0402]
R_2C  3.57k  R-EU_R0402  [R0402]
R_2D  3.57k  R-EU_R0402  [R0402]
R_2E  3.57k  R-EU_R0402  [R0402]
R_2F  3.57k  R-EU_R0402  [R0402]
R_2G  3.57k  R-EU_R0402  [R0402]
R_2H  3.57k  R-EU_R0402  [R0402]
R_2J  3.57k  R-EU_R0402  [R0402]
R_3A  3.57k  R-EU_R0402  [R0402]
R_3B  3.57k  R-EU_R0402  [R0402]
R_3C  3.57k  R-EU_R0402  [R0402]
R_3D  3.57k  R-EU_R0402  [R0402]
R_3E  3.57k  R-EU_R0402  [R0402]
R_3F  3.57k  R-EU_R0402  [R0402]
R_3G  3.57k  R-EU_R0402  [R0402]
R_3H  3.57k  R-EU_R0402  [R0402]
R_3J  3.57k  R-EU_R0402  [R0402]
R_4A  3.57k  R-EU_R0402  [R0402]
R_4B  3.57k  R-EU_R0402  [R0402]
R_4C  3.57k  R-EU_R0402  [R0402]
R_4D  3.57k  R-EU_R0402  [R0402]
R_4E  3.57k  R-EU_R0402  [R0402]
R_4F  3.57k  R-EU_R0402  [R0402]
R_4G  3.57k  R-EU_R0402  [R0402]
R_4H  3.57k  R-EU_R0402  [R0402]
R_4J  3.57k  R-EU_R0402  [R0402]
R_5A  3.57k  R-EU_R0402  [R0402]
R_5B  3.57k  R-EU_R0402  [R0402]
R_5C  3.57k  R-EU_R0402  [R0402]
R_5D  3.57k  R-EU_R0402  [R0402]
R_5E  3.57k  R-EU_R0402  [R0402]
R_5F  3.57k  R-EU_R0402  [R0402]
R_5G  3.57k  R-EU_R0402  [R0402]
R_5H  3.57k  R-EU_R0402  [R0402]
R_5J  3.57k  R-EU_R0402  [R0402]
R_6A  3.57k  R-EU_R0402  [R0402]
R_6B  3.57k  R-EU_R0402  [R0402]
R_6C  3.57k  R-EU_R0402  [R0402]
R_6D  3.57k  R-EU_R0402  [R0402]
R_6E  3.57k  R-EU_R0402  [R0402]
R_6F  3.57k  R-EU_R0402  [R0402]
R_6G  3.57k  R-EU_R0402  [R0402]
R_6H  3.57k  R-EU_R0402  [R0402]
R_6J  3.57k  R-EU_R0402  [R0402]
R_7A  3.57k  R-EU_R0402  [R0402]
R_7B  3.57k  R-EU_R0402  [R0402]
R_7C  3.57k  R-EU_R0402  [R0402]
R_7D  3.57k  R-EU_R0402  [R0402]
R_7E  3.57k  R-EU_R0402  [R0402]
R_7F  3.57k  R-EU_R0402  [R0402]
R_7G  3.57k  R-EU_R0402  [R0402]
R_7H  3.57k  R-EU_R0402  [R0402]
R_7J  3.57k  R-EU_R0402  [R0402]
R_8A  3.57k  R-EU_R0402  [R0402]
R_8B  3.57k  R-EU_R0402  [R0402]
R_8C  3.57k  R-EU_R0402  [R0402]
R_8D  3.57k  R-EU_R0402  [R0402]
R_8E  3.57k  R-EU_R0402  [R0402]
R_8F  3.57k  R-EU_R0402  [R0402]
R_8G  3.57k  R-EU_R0402  [R0402]
R_8H  3.57k  R-EU_R0402  [R0402]
R_8J  3.57k  R-EU_R0402  [R0402]
SHIFTER0  SHIFT-REGISTER_74XX595SOT763-1  [SOT763-1]
SHIFTER1  SHIFT-REGISTER_74XX595SOT763-1  [SOT763-1]
SHIFTER2  SHIFT-REGISTER_74XX595SOT763-1  [SOT763-1]
SHIFTER3  SHIFT-REGISTER_74XX595SOT763-1  [SOT763-1]
SHIFTER4  SHIFT-REGISTER_74XX595SOT763-1  [SOT763-1]
SHIFTER5  SHIFT-REGISTER_74XX595SOT763-1  [SOT763-1]
SHIFTER6  SHIFT-REGISTER_74XX595SOT763-1  [SOT763-1]
SHIFTER7  SHIFT-REGISTER_74XX595SOT763-1  [SOT763-1]
SHIFTER8  SHIFT-REGISTER_74XX595SOT763-1  [SOT763-1]
SSR_1AB  SSR_COTO_C334S  [SOP8]
SSR_1CD  SSR_COTO_C334S  [SOP8]
SSR_1EF  SSR_COTO_C334S  [SOP8]
SSR_1GH  SSR_COTO_C334S  [SOP8]
SSR_1J/2A  SSR_COTO_C334S  [SOP8]
SSR_2BC  SSR_COTO_C334S  [SOP8]
SSR_2DE  SSR_COTO_C334S  [SOP8]
SSR_2FG  SSR_COTO_C334S  [SOP8]
SSR_2HJ  SSR_COTO_C334S  [SOP8]
SSR_3AB  SSR_COTO_C334S  [SOP8]
SSR_3CD  SSR_COTO_C334S  [SOP8]
SSR_3EF  SSR_COTO_C334S  [SOP8]
SSR_3GH  SSR_COTO_C334S  [SOP8]
SSR_3J/4A  SSR_COTO_C334S  [SOP8]
SSR_4BC  SSR_COTO_C334S  [SOP8]
SSR_4DE  SSR_COTO_C334S  [SOP8]
SSR_4FG  SSR_COTO_C334S  [SOP8]
SSR_4HJ  SSR_COTO_C334S  [SOP8]
SSR_5AB  SSR_COTO_C334S  [SOP8]
SSR_5CD  SSR_COTO_C334S  [SOP8]
SSR_5EF  SSR_COTO_C334S  [SOP8]
SSR_5GH  SSR_COTO_C334S  [SOP8]
SSR_5J/6A  SSR_COTO_C334S  [SOP8]
SSR_6BC  SSR_COTO_C334S  [SOP8]
SSR_6DE  SSR_COTO_C334S  [SOP8]
SSR_6FG  SSR_COTO_C334S  [SOP8]
SSR_6HJ  SSR_COTO_C334S  [SOP8]
SSR_7AB  SSR_COTO_C334S  [SOP8]
SSR_7CD  SSR_COTO_C334S  [SOP8]
SSR_7EF  SSR_COTO_C334S  [SOP8]
SSR_7GH  SSR_COTO_C334S  [SOP8]
SSR_7J/8A  SSR_COTO_C334S  [SOP8]
SSR_8BC  SSR_COTO_C334S  [SOP8]
SSR_8DE  SSR_COTO_C334S  [SOP8]
SSR_8FG  SSR_COTO_C334S  [SOP8]
SSR_8HJ  SSR_COTO_C334S  [SOP8]

### Nets
0V: SHIFTER0.8(-PWR:GND) SHIFTER0.PAD(-PWR:GND) SHIFTER1.8(-PWR:GND) SHIFTER1.PAD(-PWR:GND) SHIFTER2.8(-PWR:GND) SHIFTER2.PAD(-PWR:GND) SHIFTER3.8(-PWR:GND) SHIFTER3.PAD(-PWR:GND) SHIFTER4.8(-PWR:GND) SHIFTER4.PAD(-PWR:GND) SHIFTER5.8(-PWR:GND) SHIFTER5.PAD(-PWR:GND) SHIFTER6.8(-PWR:GND) SHIFTER6.PAD(-PWR:GND) SHIFTER7.8(-PWR:GND) SHIFTER7.PAD(-PWR:GND) SHIFTER8.8(-PWR:GND) SHIFTER8.PAD(-PWR:GND) ; also sheet 1,2
+5V: R_1A.2 R_1B.2 R_1C.2 R_1D.2 R_1E.2 R_1F.2 R_1G.2 R_1H.2 R_1J.2 R_2A.2 R_2B.2 R_2C.2 R_2D.2 R_2E.2 R_2F.2 R_2G.2 R_2H.2 R_2J.2 R_3A.2 R_3B.2 R_3C.2 R_3D.2 R_3E.2 R_3F.2 R_3G.2 R_3H.2 R_3J.2 R_4A.2 R_4B.2 R_4C.2 R_4D.2 R_4E.2 R_4F.2 R_4G.2 R_4H.2 R_4J.2 R_5A.2 R_5B.2 R_5C.2 R_5D.2 R_5E.2 R_5F.2 R_5G.2 R_5H.2 R_5J.2 R_6A.2 R_6B.2 R_6C.2 R_6D.2 R_6E.2 R_6F.2 R_6G.2 R_6H.2 R_6J.2 R_7A.2 R_7B.2 R_7C.2 R_7D.2 R_7E.2 R_7F.2 R_7G.2 R_7H.2 R_7J.2 R_8A.2 R_8B.2 R_8C.2 R_8D.2 R_8E.2 R_8F.2 R_8G.2 R_8H.2 R_8J.2 SHIFTER0.16(-PWR:VCC) SHIFTER1.16(-PWR:VCC) SHIFTER2.16(-PWR:VCC) SHIFTER3.16(-PWR:VCC) SHIFTER4.16(-PWR:VCC) SHIFTER5.16(-PWR:VCC) SHIFTER6.16(-PWR:VCC) SHIFTER7.16(-PWR:VCC) SHIFTER8.16(-PWR:VCC) ; also sheet 1,2
CH1_O+: SSR_1AB.5(-2:O1) SSR_1AB.7(-1:O1) SSR_1CD.5(-2:O1) SSR_1CD.7(-1:O1) SSR_1EF.5(-2:O1) SSR_1EF.7(-1:O1) SSR_1GH.5(-2:O1) SSR_1GH.7(-1:O1) SSR_1J/2A.7(-1:O1) ; also sheet 2
CH1_O-: P-CH1+2.12 P-CH1+2.18 ; also sheet 2
CH1_PA+: P-CH1+2.22 SSR_1AB.8(-1:O2)
CH1_PB+: P-CH1+2.21 SSR_1AB.6(-2:O2)
CH1_PC+: P-CH1+2.20 SSR_1CD.8(-1:O2)
CH1_PD+: P-CH1+2.19 SSR_1CD.6(-2:O2)
CH1_PE+: P-CH1+2.17 SSR_1EF.8(-1:O2)
CH1_PF+: P-CH1+2.16 SSR_1EF.6(-2:O2)
CH1_PG+: P-CH1+2.15 SSR_1GH.8(-1:O2)
CH1_PH+: P-CH1+2.14 SSR_1GH.6(-2:O2)
CH1_PJ+: P-CH1+2.13 SSR_1J/2A.8(-1:O2)
CH2_O+: SSR_1J/2A.5(-2:O1) SSR_2BC.5(-2:O1) SSR_2BC.7(-1:O1) SSR_2DE.5(-2:O1) SSR_2DE.7(-1:O1) SSR_2FG.5(-2:O1) SSR_2FG.7(-1:O1) SSR_2HJ.5(-2:O1) SSR_2HJ.7(-1:O1) ; also sheet 2
CH2_O-: P-CH1+2.1 P-CH1+2.7 ; also sheet 2
CH2_PA+: P-CH1+2.11 SSR_1J/2A.6(-2:O2)
CH2_PB+: P-CH1+2.10 SSR_2BC.8(-1:O2)
CH2_PC+: P-CH1+2.9 SSR_2BC.6(-2:O2)
CH2_PD+: P-CH1+2.8 SSR_2DE.8(-1:O2)
CH2_PE+: P-CH1+2.6 SSR_2DE.6(-2:O2)
CH2_PF+: P-CH1+2.5 SSR_2FG.8(-1:O2)
CH2_PG+: P-CH1+2.4 SSR_2FG.6(-2:O2)
CH2_PH+: P-CH1+2.3 SSR_2HJ.8(-1:O2)
CH2_PJ+: P-CH1+2.2 SSR_2HJ.6(-2:O2)
CH3_O+: SSR_3AB.5(-2:O1) SSR_3AB.7(-1:O1) SSR_3CD.5(-2:O1) SSR_3CD.7(-1:O1) SSR_3EF.5(-2:O1) SSR_3EF.7(-1:O1) SSR_3GH.5(-2:O1) SSR_3GH.7(-1:O1) SSR_3J/4A.7(-1:O1) ; also sheet 2
CH3_O-: P-CH3+4.12 P-CH3+4.18 ; also sheet 2
CH3_PA+: P-CH3+4.22 SSR_3AB.8(-1:O2)
CH3_PB+: P-CH3+4.21 SSR_3AB.6(-2:O2)
CH3_PC+: P-CH3+4.20 SSR_3CD.8(-1:O2)
CH3_PD+: P-CH3+4.19 SSR_3CD.6(-2:O2)
CH3_PE+: P-CH3+4.17 SSR_3EF.8(-1:O2)
CH3_PF+: P-CH3+4.16 SSR_3EF.6(-2:O2)
CH3_PG+: P-CH3+4.15 SSR_3GH.8(-1:O2)
CH3_PH+: P-CH3+4.14 SSR_3GH.6(-2:O2)
CH3_PJ+: P-CH3+4.13 SSR_3J/4A.8(-1:O2)
CH4_O+: SSR_3J/4A.5(-2:O1) SSR_4BC.5(-2:O1) SSR_4BC.7(-1:O1) SSR_4DE.5(-2:O1) SSR_4DE.7(-1:O1) SSR_4FG.5(-2:O1) SSR_4FG.7(-1:O1) SSR_4HJ.5(-2:O1) SSR_4HJ.7(-1:O1) ; also sheet 2
CH4_O-: P-CH3+4.1 P-CH3+4.7 ; also sheet 2
CH4_PA+: P-CH3+4.11 SSR_3J/4A.6(-2:O2)
CH4_PB+: P-CH3+4.10 SSR_4BC.8(-1:O2)
CH4_PC+: P-CH3+4.9 SSR_4BC.6(-2:O2)
CH4_PD+: P-CH3+4.8 SSR_4DE.8(-1:O2)
CH4_PE+: P-CH3+4.6 SSR_4DE.6(-2:O2)
CH4_PF+: P-CH3+4.5 SSR_4FG.8(-1:O2)
CH4_PG+: P-CH3+4.4 SSR_4FG.6(-2:O2)
CH4_PH+: P-CH3+4.3 SSR_4HJ.8(-1:O2)
CH4_PJ+: P-CH3+4.2 SSR_4HJ.6(-2:O2)
CH5_O+: SSR_5AB.5(-2:O1) SSR_5AB.7(-1:O1) SSR_5CD.5(-2:O1) SSR_5CD.7(-1:O1) SSR_5EF.5(-2:O1) SSR_5EF.7(-1:O1) SSR_5GH.5(-2:O1) SSR_5GH.7(-1:O1) SSR_5J/6A.7(-1:O1) ; also sheet 2
CH5_O-: P-CH5+6.12 P-CH5+6.18 ; also sheet 2
CH5_PA+: P-CH5+6.22 SSR_5AB.8(-1:O2)
CH5_PB+: P-CH5+6.21 SSR_5AB.6(-2:O2)
CH5_PC+: P-CH5+6.20 SSR_5CD.8(-1:O2)
CH5_PD+: P-CH5+6.19 SSR_5CD.6(-2:O2)
CH5_PE+: P-CH5+6.17 SSR_5EF.8(-1:O2)
CH5_PF+: P-CH5+6.16 SSR_5EF.6(-2:O2)
CH5_PG+: P-CH5+6.15 SSR_5GH.8(-1:O2)
CH5_PH+: P-CH5+6.14 SSR_5GH.6(-2:O2)
CH5_PJ+: P-CH5+6.13 SSR_5J/6A.8(-1:O2)
CH6_O+: SSR_5J/6A.5(-2:O1) SSR_6BC.5(-2:O1) SSR_6BC.7(-1:O1) SSR_6DE.5(-2:O1) SSR_6DE.7(-1:O1) SSR_6FG.5(-2:O1) SSR_6FG.7(-1:O1) SSR_6HJ.5(-2:O1) SSR_6HJ.7(-1:O1) ; also sheet 2
CH6_O-: P-CH5+6.1 P-CH5+6.7 ; also sheet 2
CH6_PA+: P-CH5+6.11 SSR_5J/6A.6(-2:O2)
CH6_PB+: P-CH5+6.10 SSR_6BC.8(-1:O2)
CH6_PC+: P-CH5+6.9 SSR_6BC.6(-2:O2)
CH6_PD+: P-CH5+6.8 SSR_6DE.8(-1:O2)
CH6_PE+: P-CH5+6.6 SSR_6DE.6(-2:O2)
CH6_PF+: P-CH5+6.5 SSR_6FG.8(-1:O2)
CH6_PG+: P-CH5+6.4 SSR_6FG.6(-2:O2)
CH6_PH+: P-CH5+6.3 SSR_6HJ.8(-1:O2)
CH6_PJ+: P-CH5+6.2 SSR_6HJ.6(-2:O2)
CH7_O+: SSR_7AB.5(-2:O1) SSR_7AB.7(-1:O1) SSR_7CD.5(-2:O1) SSR_7CD.7(-1:O1) SSR_7EF.5(-2:O1) SSR_7EF.7(-1:O1) SSR_7GH.5(-2:O1) SSR_7GH.7(-1:O1) SSR_7J/8A.7(-1:O1) ; also sheet 2
CH7_O-: P-CH7+8.12 P-CH7+8.18 ; also sheet 2
CH7_PA+: P-CH7+8.22 SSR_7AB.8(-1:O2)
CH7_PB+: P-CH7+8.21 SSR_7AB.6(-2:O2)
CH7_PC+: P-CH7+8.20 SSR_7CD.8(-1:O2)
CH7_PD+: P-CH7+8.19 SSR_7CD.6(-2:O2)
CH7_PE+: P-CH7+8.17 SSR_7EF.8(-1:O2)
CH7_PF+: P-CH7+8.16 SSR_7EF.6(-2:O2)
CH7_PG+: P-CH7+8.15 SSR_7GH.8(-1:O2)
CH7_PH+: P-CH7+8.14 SSR_7GH.6(-2:O2)
CH7_PJ+: P-CH7+8.13 SSR_7J/8A.8(-1:O2)
CH8_O+: SSR_7J/8A.5(-2:O1) SSR_8BC.5(-2:O1) SSR_8BC.7(-1:O1) SSR_8DE.5(-2:O1) SSR_8DE.7(-1:O1) SSR_8FG.5(-2:O1) SSR_8FG.7(-1:O1) SSR_8HJ.5(-2:O1) SSR_8HJ.7(-1:O1) ; also sheet 2
CH8_O-: P-CH7+8.1 P-CH7+8.7 ; also sheet 2
CH8_PA+: P-CH7+8.11 SSR_7J/8A.6(-2:O2)
CH8_PB+: P-CH7+8.10 SSR_8BC.8(-1:O2)
CH8_PC+: P-CH7+8.9 SSR_8BC.6(-2:O2)
CH8_PD+: P-CH7+8.8 SSR_8DE.8(-1:O2)
CH8_PE+: P-CH7+8.6 SSR_8DE.6(-2:O2)
CH8_PF+: P-CH7+8.5 SSR_8FG.8(-1:O2)
CH8_PG+: P-CH7+8.4 SSR_8FG.6(-2:O2)
CH8_PH+: P-CH7+8.3 SSR_8HJ.8(-1:O2)
CH8_PJ+: P-CH7+8.2 SSR_8HJ.6(-2:O2)
N$52: R_3A.1 SSR_3AB.1(-1:I+)
N$53: R_3B.1 SSR_3AB.3(-2:I+)
N$54: R_3C.1 SSR_3CD.1(-1:I+)
N$55: R_3D.1 SSR_3CD.3(-2:I+)
N$56: R_3E.1 SSR_3EF.1(-1:I+)
N$57: R_3F.1 SSR_3EF.3(-2:I+)
N$58: R_3G.1 SSR_3GH.1(-1:I+)
N$59: R_3H.1 SSR_3GH.3(-2:I+)
N$60: R_3J.1 SSR_3J/4A.1(-1:I+)
N$61: R_4A.1 SSR_3J/4A.3(-2:I+)
N$62: R_4B.1 SSR_4BC.1(-1:I+)
N$63: R_4C.1 SSR_4BC.3(-2:I+)
N$64: R_4D.1 SSR_4DE.1(-1:I+)
N$65: R_4E.1 SSR_4DE.3(-2:I+)
N$66: R_4F.1 SSR_4FG.1(-1:I+)
N$67: R_4J.1 SSR_4HJ.3(-2:I+)
N$71: R_4H.1 SSR_4HJ.1(-1:I+)
N$72: R_4G.1 SSR_4FG.3(-2:I+)
N$73: R_5A.1 SSR_5AB.1(-1:I+)
N$74: R_5B.1 SSR_5AB.3(-2:I+)
N$75: R_5C.1 SSR_5CD.1(-1:I+)
N$76: R_5D.1 SSR_5CD.3(-2:I+)
N$77: R_5E.1 SSR_5EF.1(-1:I+)
N$78: R_5F.1 SSR_5EF.3(-2:I+)
N$79: R_5G.1 SSR_5GH.1(-1:I+)
N$80: R_5H.1 SSR_5GH.3(-2:I+)
N$81: R_5J.1 SSR_5J/6A.1(-1:I+)
N$82: R_6A.1 SSR_5J/6A.3(-2:I+)
N$83: R_6B.1 SSR_6BC.1(-1:I+)
N$84: R_6C.1 SSR_6BC.3(-2:I+)
N$85: R_6D.1 SSR_6DE.1(-1:I+)
N$86: R_6E.1 SSR_6DE.3(-2:I+)
N$87: R_6F.1 SSR_6FG.1(-1:I+)
N$88: R_6J.1 SSR_6HJ.3(-2:I+)
N$89: R_6H.1 SSR_6HJ.1(-1:I+)
N$90: R_6G.1 SSR_6FG.3(-2:I+)
N$91: R_7A.1 SSR_7AB.1(-1:I+)
N$92: R_7B.1 SSR_7AB.3(-2:I+)
N$93: R_7C.1 SSR_7CD.1(-1:I+)
N$94: R_7D.1 SSR_7CD.3(-2:I+)
N$95: R_7E.1 SSR_7EF.1(-1:I+)
N$96: R_1A.1 SSR_1AB.1(-1:I+)
N$97: R_1B.1 SSR_1AB.3(-2:I+)
N$98: R_7F.1 SSR_7EF.3(-2:I+)
N$99: R_7G.1 SSR_7GH.1(-1:I+)
N$100: R_1C.1 SSR_1CD.1(-1:I+)
N$101: R_1D.1 SSR_1CD.3(-2:I+)
N$102: R_1E.1 SSR_1EF.1(-1:I+)
N$103: R_1F.1 SSR_1EF.3(-2:I+)
N$104: R_1G.1 SSR_1GH.1(-1:I+)
N$105: R_1H.1 SSR_1GH.3(-2:I+)
N$106: R_1J.1 SSR_1J/2A.1(-1:I+)
N$107: R_2A.1 SSR_1J/2A.3(-2:I+)
N$108: R_2B.1 SSR_2BC.1(-1:I+)
N$109: R_2C.1 SSR_2BC.3(-2:I+)
N$110: R_7H.1 SSR_7GH.3(-2:I+)
N$111: R_7J.1 SSR_7J/8A.1(-1:I+)
N$112: R_8A.1 SSR_7J/8A.3(-2:I+)
N$113: R_8B.1 SSR_8BC.1(-1:I+)
N$114: R_8C.1 SSR_8BC.3(-2:I+)
N$115: R_8D.1 SSR_8DE.1(-1:I+)
N$116: R_8E.1 SSR_8DE.3(-2:I+)
N$117: R_8F.1 SSR_8FG.1(-1:I+)
N$118: R_8J.1 SSR_8HJ.3(-2:I+)
N$119: R_2D.1 SSR_2DE.1(-1:I+)
N$120: R_2E.1 SSR_2DE.3(-2:I+)
N$121: R_2F.1 SSR_2FG.1(-1:I+)
N$122: R_2J.1 SSR_2HJ.3(-2:I+)
N$123: R_2H.1 SSR_2HJ.1(-1:I+)
N$124: R_2G.1 SSR_2FG.3(-2:I+)
N$125: R_8H.1 SSR_8HJ.1(-1:I+)
N$126: R_8G.1 SSR_8FG.3(-2:I+)
REG_CLR: SHIFTER0.10(-LOGIC:!SCLR) SHIFTER1.10(-LOGIC:!SCLR) SHIFTER2.10(-LOGIC:!SCLR) SHIFTER3.10(-LOGIC:!SCLR) SHIFTER4.10(-LOGIC:!SCLR) SHIFTER5.10(-LOGIC:!SCLR) SHIFTER6.10(-LOGIC:!SCLR) SHIFTER7.10(-LOGIC:!SCLR) SHIFTER8.10(-LOGIC:!SCLR) ; also sheet 1
REG_LOAD: SHIFTER0.12(-LOGIC:RCK) SHIFTER1.12(-LOGIC:RCK) SHIFTER2.12(-LOGIC:RCK) SHIFTER3.12(-LOGIC:RCK) SHIFTER4.12(-LOGIC:RCK) SHIFTER5.12(-LOGIC:RCK) SHIFTER6.12(-LOGIC:RCK) SHIFTER7.12(-LOGIC:RCK) SHIFTER8.12(-LOGIC:RCK) ; also sheet 1
REG_OE: SHIFTER0.13(-LOGIC:!G) SHIFTER1.13(-LOGIC:!G) SHIFTER2.13(-LOGIC:!G) SHIFTER3.13(-LOGIC:!G) SHIFTER4.13(-LOGIC:!G) SHIFTER5.13(-LOGIC:!G) SHIFTER6.13(-LOGIC:!G) SHIFTER7.13(-LOGIC:!G) SHIFTER8.13(-LOGIC:!G) ; also sheet 1
SPI_MOSI: SHIFTER0.14(-LOGIC:SI) ; also sheet 1
SPI_SCLK: SHIFTER0.11(-LOGIC:SCK) SHIFTER1.11(-LOGIC:SCK) SHIFTER2.11(-LOGIC:SCK) SHIFTER3.11(-LOGIC:SCK) SHIFTER4.11(-LOGIC:SCK) SHIFTER5.11(-LOGIC:SCK) SHIFTER6.11(-LOGIC:SCK) SHIFTER7.11(-LOGIC:SCK) SHIFTER8.11(-LOGIC:SCK) ; also sheet 1
SPI_SO1-SI2: SHIFTER0.9(-LOGIC:SO) SHIFTER1.14(-LOGIC:SI)
SPI_SO2-SI3: SHIFTER1.9(-LOGIC:SO) SHIFTER2.14(-LOGIC:SI)
SPI_SO3-SI4: SHIFTER2.9(-LOGIC:SO) SHIFTER3.14(-LOGIC:SI)
SPI_SO4-SI5: SHIFTER3.9(-LOGIC:SO) SHIFTER4.14(-LOGIC:SI)
SPI_SO5-SI6: SHIFTER4.9(-LOGIC:SO) SHIFTER5.14(-LOGIC:SI)
SPI_SO6-SI7: SHIFTER5.9(-LOGIC:SO) SHIFTER6.14(-LOGIC:SI)
SPI_SO7-SI8: SHIFTER6.9(-LOGIC:SO) SHIFTER7.14(-LOGIC:SI)
SPI_SO8-SI9: SHIFTER7.9(-LOGIC:SO) SHIFTER8.14(-LOGIC:SI)
SW-1A: SHIFTER0.15(-LOGIC:Q0) SSR_1AB.2(-1:I-)
SW-1B: SHIFTER0.1(-LOGIC:Q1) SSR_1AB.4(-2:I-)
SW-1C: SHIFTER0.2(-LOGIC:Q2) SSR_1CD.2(-1:I-)
SW-1D: SHIFTER0.3(-LOGIC:Q3) SSR_1CD.4(-2:I-)
SW-1E: SHIFTER0.4(-LOGIC:Q4) SSR_1EF.2(-1:I-)
SW-1F: SHIFTER0.5(-LOGIC:Q5) SSR_1EF.4(-2:I-)
SW-1G: SHIFTER0.6(-LOGIC:Q6) SSR_1GH.2(-1:I-)
SW-1H: SHIFTER0.7(-LOGIC:Q7) SSR_1GH.4(-2:I-)
SW-1J: SHIFTER1.15(-LOGIC:Q0) SSR_1J/2A.2(-1:I-)
SW-2A: SHIFTER1.1(-LOGIC:Q1) SSR_1J/2A.4(-2:I-)
SW-2B: SHIFTER1.2(-LOGIC:Q2) SSR_2BC.2(-1:I-)
SW-2C: SHIFTER1.3(-LOGIC:Q3) SSR_2BC.4(-2:I-)
SW-2D: SHIFTER1.4(-LOGIC:Q4) SSR_2DE.2(-1:I-)
SW-2E: SHIFTER1.5(-LOGIC:Q5) SSR_2DE.4(-2:I-)
SW-2F: SHIFTER1.6(-LOGIC:Q6) SSR_2FG.2(-1:I-)
SW-2G: SHIFTER1.7(-LOGIC:Q7) SSR_2FG.4(-2:I-)
SW-2H: SHIFTER2.15(-LOGIC:Q0) SSR_2HJ.2(-1:I-)
SW-2J: SHIFTER2.1(-LOGIC:Q1) SSR_2HJ.4(-2:I-)
SW-3A: SHIFTER2.2(-LOGIC:Q2) SSR_3AB.2(-1:I-)
SW-3B: SHIFTER2.3(-LOGIC:Q3) SSR_3AB.4(-2:I-)
SW-3C: SHIFTER2.4(-LOGIC:Q4) SSR_3CD.2(-1:I-)
SW-3D: SHIFTER2.5(-LOGIC:Q5) SSR_3CD.4(-2:I-)
SW-3E: SHIFTER2.6(-LOGIC:Q6) SSR_3EF.2(-1:I-)
SW-3F: SHIFTER2.7(-LOGIC:Q7) SSR_3EF.4(-2:I-)
SW-3G: SHIFTER3.15(-LOGIC:Q0) SSR_3GH.2(-1:I-)
SW-3H: SHIFTER3.1(-LOGIC:Q1) SSR_3GH.4(-2:I-)
SW-3J: SHIFTER3.2(-LOGIC:Q2) SSR_3J/4A.2(-1:I-)
SW-4A: SHIFTER3.3(-LOGIC:Q3) SSR_3J/4A.4(-2:I-)
SW-4B: SHIFTER3.4(-LOGIC:Q4) SSR_4BC.2(-1:I-)
SW-4C: SHIFTER3.5(-LOGIC:Q5) SSR_4BC.4(-2:I-)
SW-4D: SHIFTER3.6(-LOGIC:Q6) SSR_4DE.2(-1:I-)
SW-4E: SHIFTER3.7(-LOGIC:Q7) SSR_4DE.4(-2:I-)
SW-4F: SHIFTER4.15(-LOGIC:Q0) SSR_4FG.2(-1:I-)
SW-4G: SHIFTER4.1(-LOGIC:Q1) SSR_4FG.4(-2:I-)
SW-4H: SHIFTER4.2(-LOGIC:Q2) SSR_4HJ.2(-1:I-)
SW-4J: SHIFTER4.3(-LOGIC:Q3) SSR_4HJ.4(-2:I-)
SW-5A: SHIFTER4.4(-LOGIC:Q4) SSR_5AB.2(-1:I-)
SW-5B: SHIFTER4.5(-LOGIC:Q5) SSR_5AB.4(-2:I-)
SW-5C: SHIFTER4.6(-LOGIC:Q6) SSR_5CD.2(-1:I-)
SW-5D: SHIFTER4.7(-LOGIC:Q7) SSR_5CD.4(-2:I-)
SW-5E: SHIFTER5.15(-LOGIC:Q0) SSR_5EF.2(-1:I-)
SW-5F: SHIFTER5.1(-LOGIC:Q1) SSR_5EF.4(-2:I-)
SW-5G: SHIFTER5.2(-LOGIC:Q2) SSR_5GH.2(-1:I-)
SW-5H: SHIFTER5.3(-LOGIC:Q3) SSR_5GH.4(-2:I-)
SW-5J: SHIFTER5.4(-LOGIC:Q4) SSR_5J/6A.2(-1:I-)
SW-6A: SHIFTER5.5(-LOGIC:Q5) SSR_5J/6A.4(-2:I-)
SW-6B: SHIFTER5.6(-LOGIC:Q6) SSR_6BC.2(-1:I-)
SW-6C: SHIFTER5.7(-LOGIC:Q7) SSR_6BC.4(-2:I-)
SW-6D: SHIFTER6.15(-LOGIC:Q0) SSR_6DE.2(-1:I-)
SW-6E: SHIFTER6.1(-LOGIC:Q1) SSR_6DE.4(-2:I-)
SW-6F: SHIFTER6.2(-LOGIC:Q2) SSR_6FG.2(-1:I-)
SW-6G: SHIFTER6.3(-LOGIC:Q3) SSR_6FG.4(-2:I-)
SW-6H: SHIFTER6.4(-LOGIC:Q4) SSR_6HJ.2(-1:I-)
SW-6J: SHIFTER6.5(-LOGIC:Q5) SSR_6HJ.4(-2:I-)
SW-7A: SHIFTER6.6(-LOGIC:Q6) SSR_7AB.2(-1:I-)
SW-7B: SHIFTER6.7(-LOGIC:Q7) SSR_7AB.4(-2:I-)
SW-7C: SHIFTER7.15(-LOGIC:Q0) SSR_7CD.2(-1:I-)
SW-7D: SHIFTER7.1(-LOGIC:Q1) SSR_7CD.4(-2:I-)
SW-7E: SHIFTER7.2(-LOGIC:Q2) SSR_7EF.2(-1:I-)
SW-7F: SHIFTER7.3(-LOGIC:Q3) SSR_7EF.4(-2:I-)
SW-7G: SHIFTER7.4(-LOGIC:Q4) SSR_7GH.2(-1:I-)
SW-7H: SHIFTER7.5(-LOGIC:Q5) SSR_7GH.4(-2:I-)
SW-7J: SHIFTER7.6(-LOGIC:Q6) SSR_7J/8A.2(-1:I-)
SW-8A: SHIFTER7.7(-LOGIC:Q7) SSR_7J/8A.4(-2:I-)
SW-8B: SHIFTER8.15(-LOGIC:Q0) SSR_8BC.2(-1:I-)
SW-8C: SHIFTER8.1(-LOGIC:Q1) SSR_8BC.4(-2:I-)
SW-8D: SHIFTER8.2(-LOGIC:Q2) SSR_8DE.2(-1:I-)
SW-8E: SHIFTER8.3(-LOGIC:Q3) SSR_8DE.4(-2:I-)
SW-8F: SHIFTER8.4(-LOGIC:Q4) SSR_8FG.2(-1:I-)
SW-8G: SHIFTER8.5(-LOGIC:Q5) SSR_8FG.4(-2:I-)
SW-8H: SHIFTER8.6(-LOGIC:Q6) SSR_8HJ.2(-1:I-)
SW-8J: SHIFTER8.7(-LOGIC:Q7) SSR_8HJ.4(-2:I-)
Unconnected: SHIFTER8.9(-LOGIC:SO)

### Notes on the sheet
- Shift registers
- Supply
- Relays 1-8(A-J) | Connectors
- CH 1-2 | CH 3-4
- CH 5-6 | CH 7-8
- OUTPUT STAGE

## Library data of the parts
ARDUINO_A ARDUINO_D = ICST:PINHD-1X15: PIN HEADER
AUDIO_IN = ICST:F25HP: SUB-D; OC_FARNELL: unknown; OC_NEWARK: unknown
C_SUP1 = SABRe:CAP_POL1206
C_SUP2 CPUMP1-CPUMP8 CVBST1-CVBST8 CVDD1-CVDD8 CVREG1-CVREG8 = SABRe:C-EU: CAPACITOR, European symbol
DRV1-DRV8 = ICST:DRV2667
GND_LIFT = ICST:SWITCH_DPDT
HEADER_EXT = ICST:PINHD-1X12: PIN HEADER
I2C_SWITCH = ICST:I2C-SWITCH_8-1
L1-L8 = SABRe:L-EU: INDUCTOR, European symbol
LED1-LED3 LED_SUP = SABRe:LED: LEDs Standard schematic elements and footprints for packages: 5mm 3mm 1206 0603
P-CH1+2 P-CH3+4 P-CH5+6 P-CH7+8 = ICST:FH12-22S-1SH
PWR: = SABRe:LUMBERG-1613-14
R_1A R_1B R_1C R_1D R_1E R_1F R_1G R_1H R_1J R_2A R_2B R_2C R_2D R_2E R_2F R_2G R_2H R_2J R_3A R_3B R_3C R_3D R_3E R_3F R_3G R_3H R_3J R_4A R_4B R_4C R_4D R_4E R_4F R_4G R_4H R_4J R_5A R_5B R_5C R_5D R_5E R_5F R_5G R_5H R_5J R_6A R_6B R_6C R_6D R_6E R_6F R_6G R_6H R_6J R_7A R_7B R_7C R_7D R_7E R_7F R_7G R_7H R_7J R_8A R_8B R_8C R_8D R_8E R_8F R_8G R_8H R_8J R_CLR R_LIFT1 R_LIFT2 R_LOAD R_OE R_RST R_SCL R_SCL1-R_SCL8 R_SDA R_SDA1-R_SDA8 REXT1-REXT8 RLED1-RLED3 RLED_SUP RVBST1-1 RVBST1-2 RVBST2-1 RVBST2-2 RVBST3-1 RVBST3-2 RVBST4-1 RVBST4-2 RVBST5-1 RVBST5-2 RVBST6-1 RVBST6-2 RVBST7-1 RVBST7-2 RVBST8-1 RVBST8-2 = SABRe:R-EU_: RESISTOR, European symbol
SHIFTER0 SHIFTER1-SHIFTER8 = ICST:SHIFT-REGISTER_74XX595
SSR_1AB SSR_1CD SSR_1EF SSR_1GH SSR_1J/2A SSR_2BC SSR_2DE SSR_2FG SSR_2HJ SSR_3AB SSR_3CD SSR_3EF SSR_3GH SSR_3J/4A SSR_4BC SSR_4DE SSR_4FG SSR_4HJ SSR_5AB SSR_5CD SSR_5EF SSR_5GH SSR_5J/6A SSR_6BC SSR_6DE SSR_6FG SSR_6HJ SSR_7AB SSR_7CD SSR_7EF SSR_7GH SSR_7J/8A SSR_8BC SSR_8DE SSR_8FG SSR_8HJ = ICST:SSR_COTO_C334S